# Altium project ADC1X2200-10_V1-1.PrjPCB (part 1 of 2)
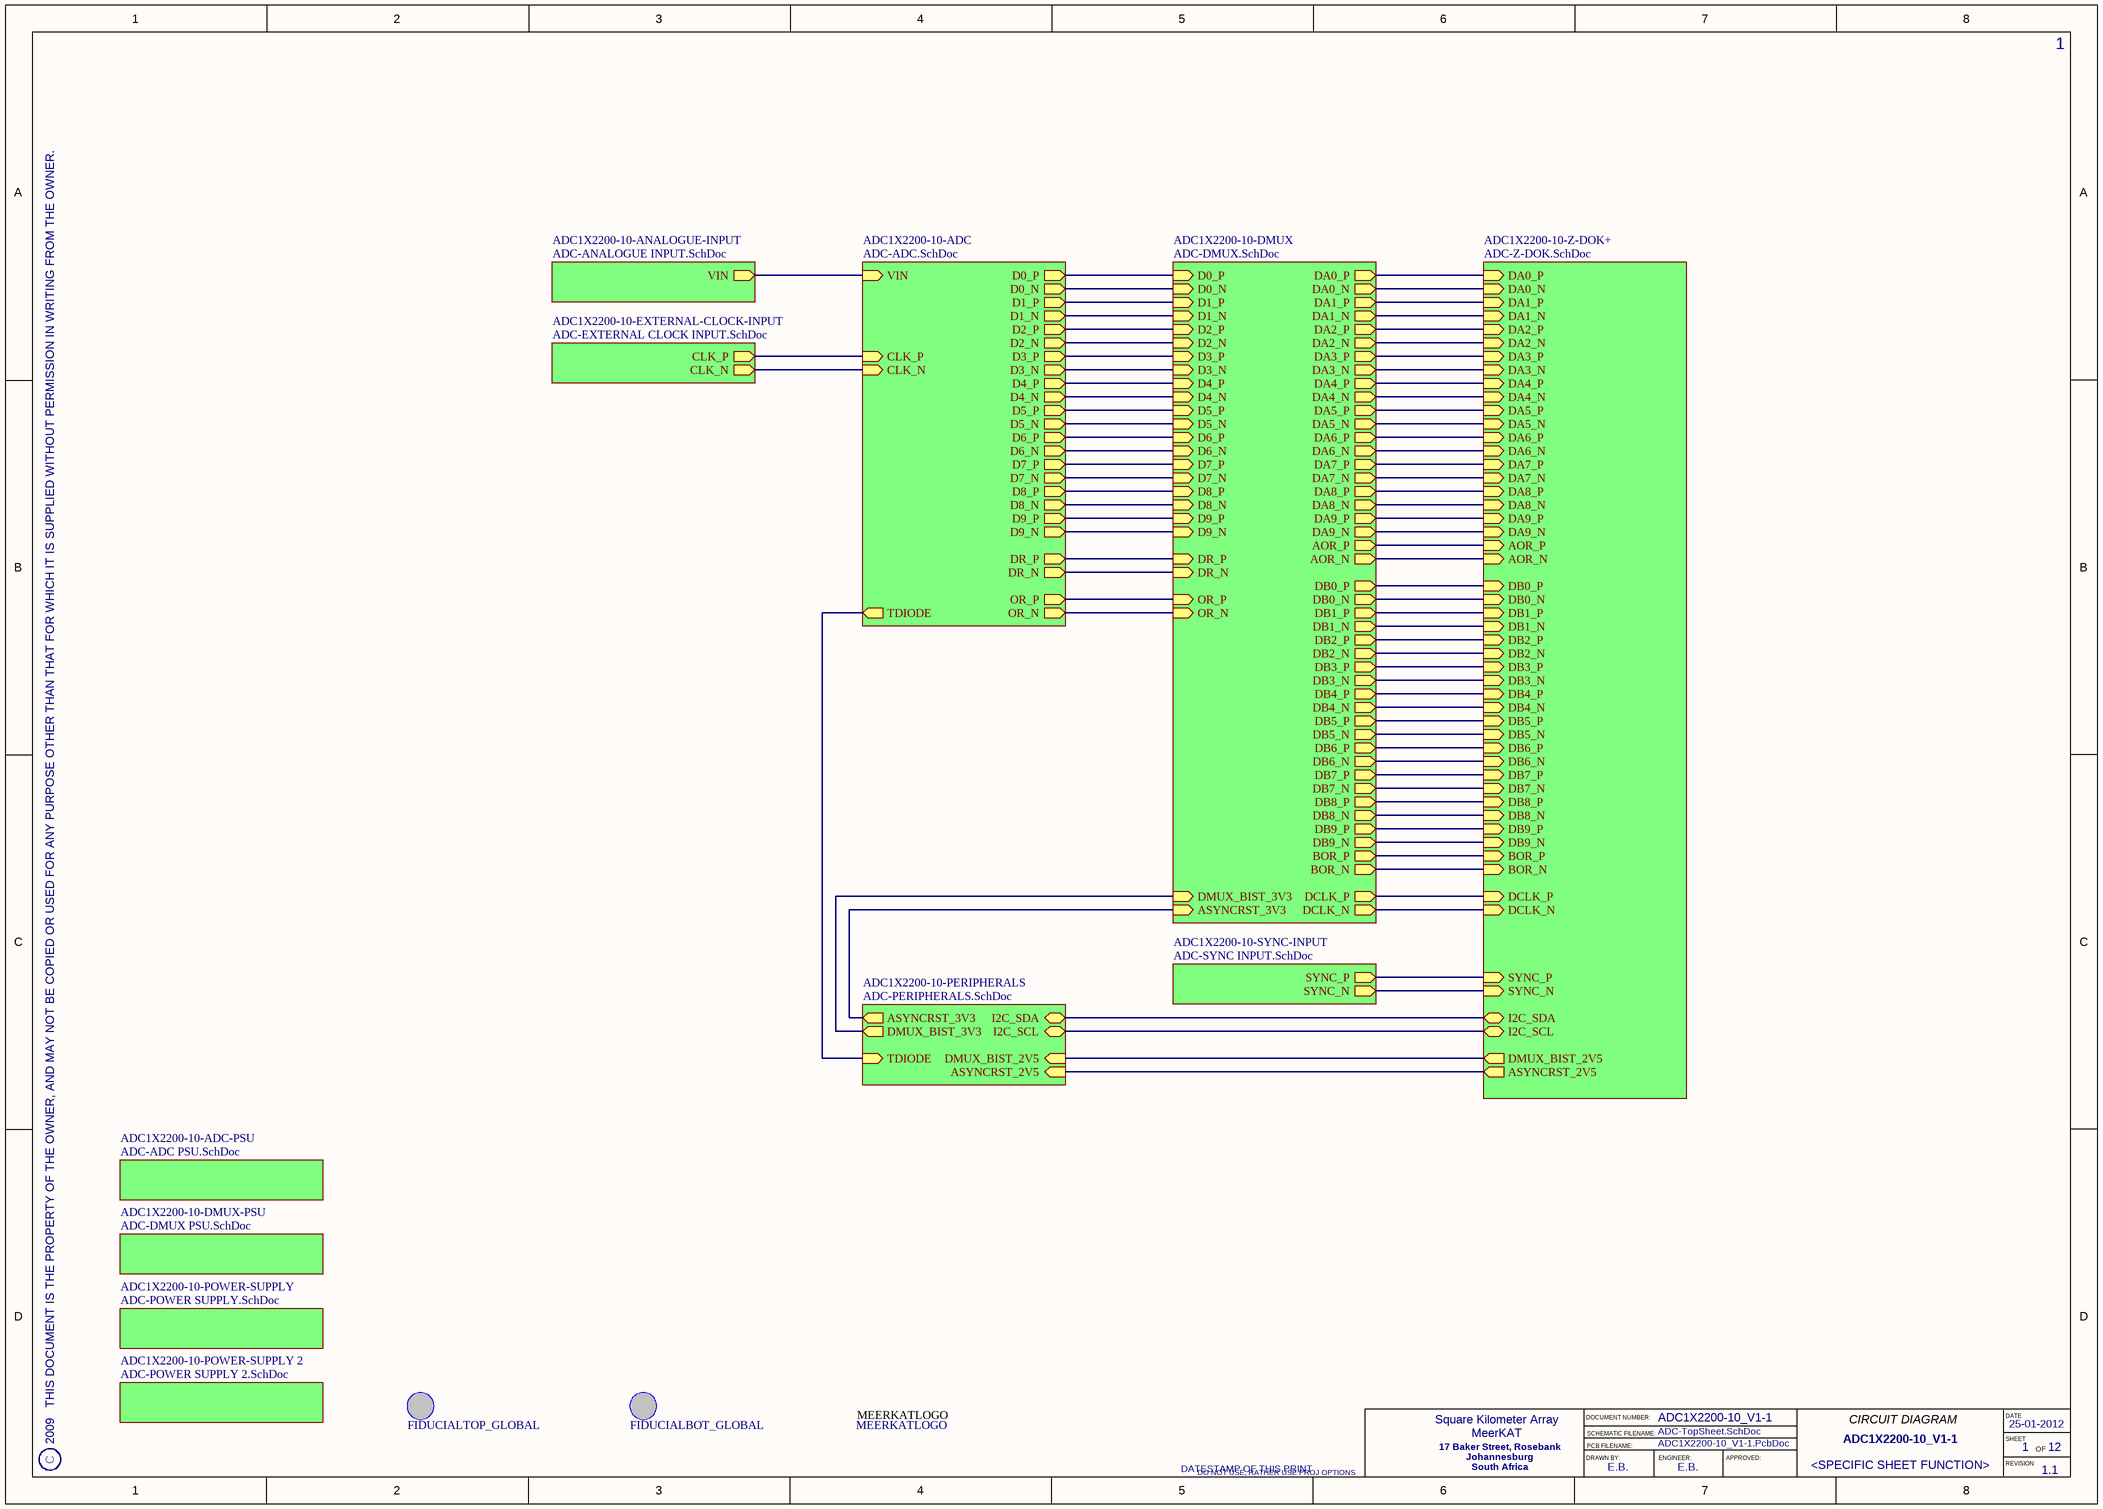
[diagram p0: ADC-TopSheet.SchDoc]
COMPANY_ADDRESS_1: 17 Baker Street, Rosebank; COMPANY_ADDRESS_2: Johannesburg; COMPANY_ADDRESS_3: South Africa; COMPANY_NAME1: Square Kilometer Array; COMPANY_NAME2: MeerKAT; COPYRIGHT_YEAR: 2012; GERBER FILENAME: ADC1X2200-10_V1-1; PCB_REVISION: 1.1; PCB_Title_Date: 25-01-2012; PCB_Title_Description: ADC1X2200-10_V1-1; PCB_Title_DocumentNumber: ADC1X2200-10_V1-1; PCB_Title_DrawnBy: E.B.; PCB_Title_Engineer: E.B.; PCB_Title_Filename: ADC1X2200-10_V1-1.PcbDoc; PROJECT_Filename: ADC1X2200-10_V1-1.PrjPCB; PROJECT_TITLE: ADC1X2200-10_V1-1; SCH_Title_Date: 25-01-2012; SCH_Title_DocumentNumber: ADC1X2200-10_V1-1; SCH_Title_DrawnBy: E.B.; SCH_Title_Engineer: E.B.
12 sheets, 237 parts. Net scope: hierarchical (ports join the sheet entries above them; power ports are global).
Board file: ADC1X2200-10_V1-1.PcbDoc
Sheets:
  ADC-TopSheet.SchDoc
    ADC1X2200-10-EXTERNAL-CLOCK-INPUT = ADC-EXTERNAL CLOCK INPUT.SchDoc
    ADC1X2200-10-ANALOGUE-INPUT = ADC-ANALOGUE INPUT.SchDoc
    ADC1X2200-10-PERIPHERALS = ADC-PERIPHERALS.SchDoc
    ADC1X2200-10-DMUX = ADC-DMUX.SchDoc
    ADC1X2200-10-Z-DOK+ = ADC-Z-DOK.SchDoc
    ADC1X2200-10-ADC = ADC-ADC.SchDoc
    ADC1X2200-10-POWER-SUPPLY 2 = ADC-POWER SUPPLY 2.SchDoc
    ADC1X2200-10-SYNC-INPUT = ADC-SYNC INPUT.SchDoc
    ADC1X2200-10-DMUX-PSU = ADC-DMUX PSU.SchDoc
    ADC1X2200-10-ADC-PSU = ADC-ADC PSU.SchDoc
    ADC1X2200-10-POWER-SUPPLY = ADC-POWER SUPPLY.SchDoc

## Sheet ADC-TopSheet.SchDoc: <SPECIFIC SHEET FUNCTION>
size A3; Date: DO NOT USE, RATHER USE PROJ OPTIONS; DrawnBy: DO NOT USE, RATHER USE PROJ OPTIONS; Engineer: DO NOT USE, RATHER USE PROJ OPTIONS; Organization: DO NOT USE, RATHER USE PROJ OPTIONS; DocumentNumber: 1; Revision: DO NOT USE, RATHER USE PROJ OPTIONS; SheetNumber: 1; SheetTotal: 12; SCH_Sheet_Filename: ADC-TopSheet.SchDoc; CurrentTime: DO NOT USE, RATHER USE PROJ OPTIONS; Time: DO NOT USE, RATHER USE PROJ OPTIONS; DocumentFullPathAndName: DO NOT USE, RATHER USE PROJ OPTIONS; DocumentName: DO NOT USE, RATHER USE PROJ OPTIONS; ModifiedDate: DO NOT USE, RATHER USE PROJ OPTIONS; ImagePath: DO NOT USE, RATHER USE PROJ OPTIONS

### Parts
F1  FIDUCIALTOP_GLOBAL  [FiducialTop_Global]
F4  FIDUCIALBOT_GLOBAL  [FiducialBot_Global]
LOGO1  MEERKATLOGO  [MEERKATLOGO]

### Sub-sheets
ADC1X2200-10-ADC = ADC-ADC.SchDoc: D0_P (out), D0_N (out), D1_P (out), D1_N (out), D2_P (out), D2_N (out), D3_P (out), D3_N (out), D4_P (out), D4_N (out), D5_P (out), D5_N (out), D6_P (out), D6_N (out), D7_P (out), D7_N (out), D8_P (out), D8_N (out), D9_P (out), D9_N (out), TDIODE (out), VIN (in), CLK_P (in), CLK_N (in), OR_P (out), OR_N (out), DR_P (out), DR_N (out)
ADC1X2200-10-ADC-PSU = ADC-ADC PSU.SchDoc: no entries
ADC1X2200-10-ANALOGUE-INPUT = ADC-ANALOGUE INPUT.SchDoc: VIN (out)
ADC1X2200-10-DMUX = ADC-DMUX.SchDoc: D0_P (in), D0_N (in), D1_P (in), D1_N (in), D2_P (in), D2_N (in), D3_P (in), D3_N (in), D4_P (in), D4_N (in), D5_P (in), D5_N (in), D6_P (in), D6_N (in), D7_P (in), D7_N (in), D8_P (in), D8_N (in), D9_P (in), D9_N (in), DA0_P (out), DA0_N (out), DA1_P (out), DA1_N (out), DA2_P (out), DA2_N (out), DA3_P (out), DA3_N (out), DA4_P (out), DA4_N (out), DA5_P (out), DA5_N (out), DA6_P (out), DA6_N (out), DA7_P (out), DA7_N (out), DA8_P (out), DA8_N (out), DA9_P (out), DA9_N (out), DB0_P (out), DB0_N (out), DB1_P (out), DB1_N (out), DB2_P (out), DB2_N (out), DB3_P (out), DB3_N (out), DB4_P (out), DB4_N (out), DB5_P (out), DB5_N (out), DB6_P (out), DB6_N (out), DB7_P (out), DB7_N (out), DB8_P (out), DB8_N (out), DB9_P (out), DB9_N (out), DCLK_N (out), DCLK_P (out), ASYNCRST_3V3 (in), DR_P (in), DR_N (in), OR_P (in), OR_N (in), AOR_P (out), AOR_N (out), BOR_P (out), BOR_N (out), DMUX_BIST_3V3 (in)
ADC1X2200-10-DMUX-PSU = ADC-DMUX PSU.SchDoc: no entries
ADC1X2200-10-EXTERNAL-CLOCK-INPUT = ADC-EXTERNAL CLOCK INPUT.SchDoc: CLK_P (out), CLK_N (out)
ADC1X2200-10-PERIPHERALS = ADC-PERIPHERALS.SchDoc: TDIODE (in), I2C_SDA (bidir), I2C_SCL, ASYNCRST_2V5 (in), ASYNCRST_3V3 (out), DMUX_BIST_2V5 (in), DMUX_BIST_3V3 (out)
ADC1X2200-10-POWER-SUPPLY = ADC-POWER SUPPLY.SchDoc: no entries
ADC1X2200-10-POWER-SUPPLY 2 = ADC-POWER SUPPLY 2.SchDoc: no entries
ADC1X2200-10-SYNC-INPUT = ADC-SYNC INPUT.SchDoc: SYNC_P (out), SYNC_N (out)
ADC1X2200-10-Z-DOK+ = ADC-Z-DOK.SchDoc: DA0_P (in), DA0_N (in), DA1_P (in), DA1_N (in), DA2_P (in), DA2_N (in), DA3_P (in), DA3_N (in), DA4_P (in), DA4_N (in), DA5_P (in), DA5_N (in), DA6_P (in), DA6_N (in), DA7_P (in), DA7_N (in), DA8_P (in), DA8_N (in), DA9_P (in), DA9_N (in), DB0_P (in), DB0_N (in), DB1_P (in), DB1_N (in), DB2_P (in), DB2_N (in), DB3_P (in), DB3_N (in), DB4_P (in), DB4_N (in), DB5_P (in), DB5_N (in), DB6_P (in), DB6_N (in), DB7_P (in), DB7_N (in), DB8_P (in), DB8_N (in), DB9_P (in), DB9_N (in), I2C_SDA (bidir), I2C_SCL (bidir), ASYNCRST_2V5 (out), SYNC_P (in), SYNC_N (in), DCLK_N (in), DCLK_P (in), AOR_P (in), AOR_N (in), BOR_P (in), BOR_N (in), DMUX_BIST_2V5 (out)

### Nets
AOR_N: sheet ADC1X2200-10-DMUX/AOR_N, sheet ADC1X2200-10-Z-DOK+/AOR_N
AOR_P: sheet ADC1X2200-10-DMUX/AOR_P, sheet ADC1X2200-10-Z-DOK+/AOR_P
ASYNCRST_2V5: sheet ADC1X2200-10-PERIPHERALS/ASYNCRST_2V5, sheet ADC1X2200-10-Z-DOK+/ASYNCRST_2V5
ASYNCRST_3V3: sheet ADC1X2200-10-PERIPHERALS/ASYNCRST_3V3, sheet ADC1X2200-10-DMUX/ASYNCRST_3V3
BOR_N: sheet ADC1X2200-10-DMUX/BOR_N, sheet ADC1X2200-10-Z-DOK+/BOR_N
BOR_P: sheet ADC1X2200-10-DMUX/BOR_P, sheet ADC1X2200-10-Z-DOK+/BOR_P
CLK_N: sheet ADC1X2200-10-EXTERNAL-CLOCK-INPUT/CLK_N, sheet ADC1X2200-10-ADC/CLK_N
CLK_P: sheet ADC1X2200-10-EXTERNAL-CLOCK-INPUT/CLK_P, sheet ADC1X2200-10-ADC/CLK_P
D0_N: sheet ADC1X2200-10-DMUX/D0_N, sheet ADC1X2200-10-ADC/D0_N
D0_P: sheet ADC1X2200-10-DMUX/D0_P, sheet ADC1X2200-10-ADC/D0_P
D1_N: sheet ADC1X2200-10-DMUX/D1_N, sheet ADC1X2200-10-ADC/D1_N
D1_P: sheet ADC1X2200-10-DMUX/D1_P, sheet ADC1X2200-10-ADC/D1_P
D2_N: sheet ADC1X2200-10-DMUX/D2_N, sheet ADC1X2200-10-ADC/D2_N
D2_P: sheet ADC1X2200-10-DMUX/D2_P, sheet ADC1X2200-10-ADC/D2_P
D3_N: sheet ADC1X2200-10-DMUX/D3_N, sheet ADC1X2200-10-ADC/D3_N
D3_P: sheet ADC1X2200-10-DMUX/D3_P, sheet ADC1X2200-10-ADC/D3_P
D4_N: sheet ADC1X2200-10-DMUX/D4_N, sheet ADC1X2200-10-ADC/D4_N
D4_P: sheet ADC1X2200-10-DMUX/D4_P, sheet ADC1X2200-10-ADC/D4_P
D5_N: sheet ADC1X2200-10-DMUX/D5_N, sheet ADC1X2200-10-ADC/D5_N
D5_P: sheet ADC1X2200-10-DMUX/D5_P, sheet ADC1X2200-10-ADC/D5_P
D6_N: sheet ADC1X2200-10-DMUX/D6_N, sheet ADC1X2200-10-ADC/D6_N
D6_P: sheet ADC1X2200-10-DMUX/D6_P, sheet ADC1X2200-10-ADC/D6_P
D7_N: sheet ADC1X2200-10-DMUX/D7_N, sheet ADC1X2200-10-ADC/D7_N
D7_P: sheet ADC1X2200-10-DMUX/D7_P, sheet ADC1X2200-10-ADC/D7_P
D8_N: sheet ADC1X2200-10-DMUX/D8_N, sheet ADC1X2200-10-ADC/D8_N
D8_P: sheet ADC1X2200-10-DMUX/D8_P, sheet ADC1X2200-10-ADC/D8_P
D9_N: sheet ADC1X2200-10-DMUX/D9_N, sheet ADC1X2200-10-ADC/D9_N
D9_P: sheet ADC1X2200-10-DMUX/D9_P, sheet ADC1X2200-10-ADC/D9_P
DA0_N: sheet ADC1X2200-10-DMUX/DA0_N, sheet ADC1X2200-10-Z-DOK+/DA0_N
DA0_P: sheet ADC1X2200-10-DMUX/DA0_P, sheet ADC1X2200-10-Z-DOK+/DA0_P
DA1_N: sheet ADC1X2200-10-DMUX/DA1_N, sheet ADC1X2200-10-Z-DOK+/DA1_N
DA1_P: sheet ADC1X2200-10-DMUX/DA1_P, sheet ADC1X2200-10-Z-DOK+/DA1_P
DA2_N: sheet ADC1X2200-10-DMUX/DA2_N, sheet ADC1X2200-10-Z-DOK+/DA2_N
DA2_P: sheet ADC1X2200-10-DMUX/DA2_P, sheet ADC1X2200-10-Z-DOK+/DA2_P
DA3_N: sheet ADC1X2200-10-DMUX/DA3_N, sheet ADC1X2200-10-Z-DOK+/DA3_N
DA3_P: sheet ADC1X2200-10-DMUX/DA3_P, sheet ADC1X2200-10-Z-DOK+/DA3_P
DA4_N: sheet ADC1X2200-10-DMUX/DA4_N, sheet ADC1X2200-10-Z-DOK+/DA4_N
DA4_P: sheet ADC1X2200-10-DMUX/DA4_P, sheet ADC1X2200-10-Z-DOK+/DA4_P
DA5_N: sheet ADC1X2200-10-DMUX/DA5_N, sheet ADC1X2200-10-Z-DOK+/DA5_N
DA5_P: sheet ADC1X2200-10-DMUX/DA5_P, sheet ADC1X2200-10-Z-DOK+/DA5_P
DA6_N: sheet ADC1X2200-10-DMUX/DA6_N, sheet ADC1X2200-10-Z-DOK+/DA6_N
DA6_P: sheet ADC1X2200-10-DMUX/DA6_P, sheet ADC1X2200-10-Z-DOK+/DA6_P
DA7_N: sheet ADC1X2200-10-DMUX/DA7_N, sheet ADC1X2200-10-Z-DOK+/DA7_N
DA7_P: sheet ADC1X2200-10-DMUX/DA7_P, sheet ADC1X2200-10-Z-DOK+/DA7_P
DA8_N: sheet ADC1X2200-10-DMUX/DA8_N, sheet ADC1X2200-10-Z-DOK+/DA8_N
DA8_P: sheet ADC1X2200-10-DMUX/DA8_P, sheet ADC1X2200-10-Z-DOK+/DA8_P
DA9_N: sheet ADC1X2200-10-DMUX/DA9_N, sheet ADC1X2200-10-Z-DOK+/DA9_N
DA9_P: sheet ADC1X2200-10-DMUX/DA9_P, sheet ADC1X2200-10-Z-DOK+/DA9_P
DB0_N: sheet ADC1X2200-10-DMUX/DB0_N, sheet ADC1X2200-10-Z-DOK+/DB0_N
DB0_P: sheet ADC1X2200-10-DMUX/DB0_P, sheet ADC1X2200-10-Z-DOK+/DB0_P
DB1_N: sheet ADC1X2200-10-DMUX/DB1_N, sheet ADC1X2200-10-Z-DOK+/DB1_N
DB1_P: sheet ADC1X2200-10-DMUX/DB1_P, sheet ADC1X2200-10-Z-DOK+/DB1_P
DB2_N: sheet ADC1X2200-10-DMUX/DB2_N, sheet ADC1X2200-10-Z-DOK+/DB2_N
DB2_P: sheet ADC1X2200-10-DMUX/DB2_P, sheet ADC1X2200-10-Z-DOK+/DB2_P
DB3_N: sheet ADC1X2200-10-DMUX/DB3_N, sheet ADC1X2200-10-Z-DOK+/DB3_N
DB3_P: sheet ADC1X2200-10-DMUX/DB3_P, sheet ADC1X2200-10-Z-DOK+/DB3_P
DB4_N: sheet ADC1X2200-10-DMUX/DB4_N, sheet ADC1X2200-10-Z-DOK+/DB4_N
DB4_P: sheet ADC1X2200-10-DMUX/DB4_P, sheet ADC1X2200-10-Z-DOK+/DB4_P
DB5_N: sheet ADC1X2200-10-DMUX/DB5_N, sheet ADC1X2200-10-Z-DOK+/DB5_N
DB5_P: sheet ADC1X2200-10-DMUX/DB5_P, sheet ADC1X2200-10-Z-DOK+/DB5_P
DB6_N: sheet ADC1X2200-10-DMUX/DB6_N, sheet ADC1X2200-10-Z-DOK+/DB6_N
DB6_P: sheet ADC1X2200-10-DMUX/DB6_P, sheet ADC1X2200-10-Z-DOK+/DB6_P
DB7_N: sheet ADC1X2200-10-DMUX/DB7_N, sheet ADC1X2200-10-Z-DOK+/DB7_N
DB7_P: sheet ADC1X2200-10-DMUX/DB7_P, sheet ADC1X2200-10-Z-DOK+/DB7_P
DB8_N: sheet ADC1X2200-10-DMUX/DB8_N, sheet ADC1X2200-10-Z-DOK+/DB8_N
DB8_P: sheet ADC1X2200-10-DMUX/DB8_P, sheet ADC1X2200-10-Z-DOK+/DB8_P
DB9_N: sheet ADC1X2200-10-DMUX/DB9_N, sheet ADC1X2200-10-Z-DOK+/DB9_N
DB9_P: sheet ADC1X2200-10-DMUX/DB9_P, sheet ADC1X2200-10-Z-DOK+/DB9_P
DCLK_N: sheet ADC1X2200-10-DMUX/DCLK_N, sheet ADC1X2200-10-Z-DOK+/DCLK_N
DCLK_P: sheet ADC1X2200-10-DMUX/DCLK_P, sheet ADC1X2200-10-Z-DOK+/DCLK_P
DMUX_BIST_2V5: sheet ADC1X2200-10-PERIPHERALS/DMUX_BIST_2V5, sheet ADC1X2200-10-Z-DOK+/DMUX_BIST_2V5
DMUX_BIST_3V3: sheet ADC1X2200-10-PERIPHERALS/DMUX_BIST_3V3, sheet ADC1X2200-10-DMUX/DMUX_BIST_3V3
DR_N: sheet ADC1X2200-10-DMUX/DR_N, sheet ADC1X2200-10-ADC/DR_N
DR_P: sheet ADC1X2200-10-DMUX/DR_P, sheet ADC1X2200-10-ADC/DR_P
I2C_SCL: sheet ADC1X2200-10-PERIPHERALS/I2C_SCL, sheet ADC1X2200-10-Z-DOK+/I2C_SCL
I2C_SDA: sheet ADC1X2200-10-PERIPHERALS/I2C_SDA, sheet ADC1X2200-10-Z-DOK+/I2C_SDA
OR_N: sheet ADC1X2200-10-DMUX/OR_N, sheet ADC1X2200-10-ADC/OR_N
OR_P: sheet ADC1X2200-10-DMUX/OR_P, sheet ADC1X2200-10-ADC/OR_P
SYNC_N: sheet ADC1X2200-10-Z-DOK+/SYNC_N, sheet ADC1X2200-10-SYNC-INPUT/SYNC_N
SYNC_P: sheet ADC1X2200-10-Z-DOK+/SYNC_P, sheet ADC1X2200-10-SYNC-INPUT/SYNC_P
TDIODE: sheet ADC1X2200-10-PERIPHERALS/TDIODE, sheet ADC1X2200-10-ADC/TDIODE
VIN: sheet ADC1X2200-10-ANALOGUE-INPUT/VIN, sheet ADC1X2200-10-ADC/VIN

### Notes on the sheet
- 2009   THIS DOCUMENT IS THE PROPERTY OF THE OWNER, AND MAY NOT BE COPIED OR USED FOR ANY PURPOSE OTHER THAN THAT FOR WHICH IT IS SUPPLIED WITHOUT PERMISSION IN WRITING FROM THE OWNER.
- C
- DATESTAMP OF THIS PRINT
- DRAWN BY:
- DOCUMENT NUMBER:
- SCHEMATIC FILENAME:
- PCB FILENAME:
- ENGINEER:
- APPROVED:
- CIRCUIT DIAGRAM
- DATE
- SHEET
- REVISION
- OF

### Library data of the parts
F1 = FIDUCIALTOP_GLOBAL: Value: ????; Manufacturer: *; Manufacturer_PN: *; Created_By: *; Checked_By: *; Checked_Date: *; HelpURL: *; ComponentLink1Description: Footprint Detail; ComponentLink1URL: *; ComponentLink2Description: Application Note; ComponentLink2URL: *; ComponentLink3Description: Layout Guidelines; ComponentLink3URL: *; ComponentLink4Description: Technology Reference; ComponentLink4URL: *; Supplier1: *; Supplier2: *; Unit_Cost: *; MOQ: *; Leadtime: *; Inventory_Stock: *; Tolerance: *; Wattage: *; Voltage: *; Package: *; ComponentLink5Description: Production Detail; ComponentLink5URL: *; Note: *; Stock Code: *
F4 = FIDUCIALBOT_GLOBAL: Value: ????; Manufacturer: *; Manufacturer_PN: *; Created_By: *; Checked_By: *; Checked_Date: *; HelpURL: *; ComponentLink1Description: Footprint Detail; ComponentLink1URL: *; ComponentLink2Description: Application Note; ComponentLink2URL: *; ComponentLink3Description: Layout Guidelines; ComponentLink3URL: *; ComponentLink4Description: Technology Reference; ComponentLink4URL: *; Supplier1: *; Supplier2: *; Unit_Cost: *; MOQ: *; Leadtime: *; Inventory_Stock: *; Tolerance: *; Wattage: *; Voltage: *; Package: *; ComponentLink5Description: Production Detail; ComponentLink5URL: *; Note: *; Stock Code: *

## Sheet ADC-EXTERNAL CLOCK INPUT.SchDoc: <SPECIFIC SHEET FUNCTION>
size A3; Date: DO NOT USE, RATHER USE PROJ OPTIONS; DrawnBy: DO NOT USE, RATHER USE PROJ OPTIONS; Engineer: DO NOT USE, RATHER USE PROJ OPTIONS; Organization: DO NOT USE, RATHER USE PROJ OPTIONS; DocumentNumber: 3; Revision: DO NOT USE, RATHER USE PROJ OPTIONS; SheetNumber: 4; SheetTotal: 12; SCH_Sheet_Filename: ADC-EXTERNAL CLOCK INPUT.SchDoc; CurrentTime: DO NOT USE, RATHER USE PROJ OPTIONS; Time: DO NOT USE, RATHER USE PROJ OPTIONS; DocumentFullPathAndName: DO NOT USE, RATHER USE PROJ OPTIONS; DocumentName: DO NOT USE, RATHER USE PROJ OPTIONS; ModifiedDate: DO NOT USE, RATHER USE PROJ OPTIONS; ImagePath: DO NOT USE, RATHER USE PROJ OPTIONS
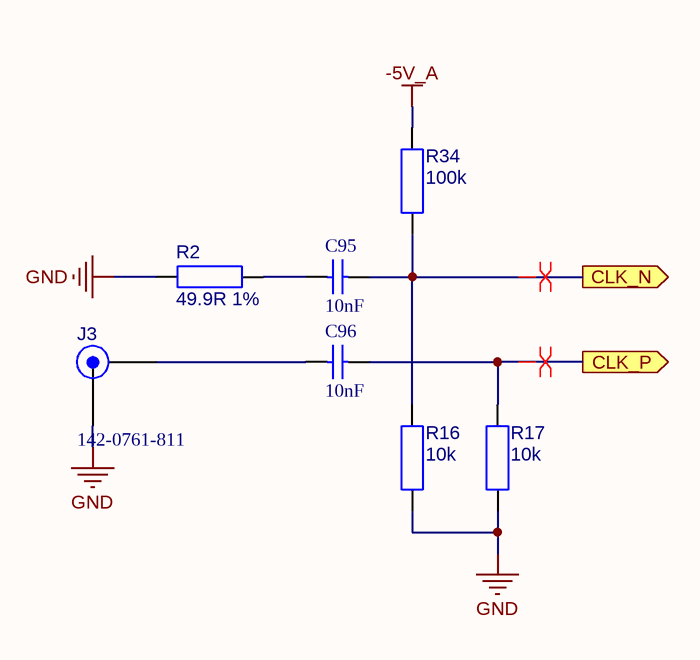
[diagram p1: ADC-EXTERNAL CLOCK INPUT.SchDoc]

### Parts
C95  value 10nF  [CAPC1005X55N]  (hidden comment: Capacitor 0402 SMD)
C96  value 10nF  [CAPC1005X55N]  (hidden comment: Capacitor 0402 SMD)
J3  142-0761-811  [EDGE_LAUNCH_TH_SMA]
R2  49.9R 1%  [0603]
R16  10k  [0603]
R17  10k  [0603]
R34  100k  [0603]

### Ports
CLK_N (out), CLK_P (out)

### Nets
-5V_A: R34.2
GND: J3.2 R2.1 R16.1 R17.1
CLK_N: C95.2 R16.2 R34.1 ; port CLK_N
CLK_P: C96.2 R17.2 ; port CLK_P
NetC95_1: C95.1 R2.2
NetC96_1: C96.1 J3.1

### Layout directives
differential pair: CLK_N, CLK_P

### Notes on the sheet
- 2009   THIS DOCUMENT IS THE PROPERTY OF THE OWNER, AND MAY NOT BE COPIED OR USED FOR ANY PURPOSE OTHER THAN THAT FOR WHICH IT IS SUPPLIED WITHOUT PERMISSION IN WRITING FROM THE OWNER.
- C
- DATESTAMP OF THIS PRINT
- DRAWN BY:
- DOCUMENT NUMBER:
- SCHEMATIC FILENAME:
- PCB FILENAME:
- ENGINEER:
- APPROVED:
- CIRCUIT DIAGRAM
- DATE
- SHEET
- REVISION
- OF

### Library data of the parts
C95 C96 = cap0402: Created_By: EDA-ASA; Checked_By: *; Checked_Date: *; HelpURL: *; Supplier1: *; Supplier2: *; Unit_Cost: *; MOQ: *; Leadtime: *; Inventory_Stock: *; Tolerance: *; Wattage: *; Package: 0402; ComponentLinked1Description: *; ComponentLinked1URL: *; ComponentLinked2Description: *; ComponentLinked2URL: *; ComponentLinked3Description: *; ComponentLinked3URL: *; ComponentLinked4Description: *; ComponentLinked4URL: *
J3 = 142-0761-811: High Frequency SMA End Lauch Connector; Manufacturer: JOHNSON; Created_By: CT; Checked_By: *; Checked_Date: *; HelpURL: *; ComponentLink1Description: High Frequency SMA End Lauch Connector; ComponentLink1URL: *; ComponentLink2Description: Application Note; ComponentLink2URL: *; ComponentLink3Description: Layout Guidelines; ComponentLink3URL: *; ComponentLink4Description: Technology Reference; ComponentLink4URL: *; Supplier1: *; Supplier2: *; Unit_Cost: *; MOQ: *; Leadtime: *; Inventory_Stock: *; Tolerance: *; Wattage: *; Package: *; ComponentLink5Description: Production Detail; ComponentLink5URL: *; Note: *; Stock Code: *; Voltage: *; Manufacturer_PN: 142-0761-811
R2 R16 R17 R34 = RES-0805: RESISTOR SMD 0603; Checked_By: NN; Manufacturer: *; Manufacturer_PN: *; Created_By: *; Checked_Date: 5-08-2009; HelpURL: *; ComponentLink1Description: Footprint Detail; ComponentLink1URL: *; ComponentLink2Description: Application Note; ComponentLink2URL: *; ComponentLink3Description: Layout Guidelines; ComponentLink3URL: *; ComponentLink4Description: Technology Reference; ComponentLink4URL: *; Supplier1: *; Supplier2: *; Unit_Cost: *; MOQ: *; Leadtime: *; Inventory_Stock: *; Tolerance: *; Wattage: *; Voltage: *; Package: 0603; ComponentLink5Description: Production Detail; ComponentLink5URL: *; Note: *; Stock Code: *
  R2: Value: 49.9R 1%
  R16 R17: Value: 10k
  R34: Value: 100k

## Sheet ADC-ANALOGUE INPUT.SchDoc: <SPECIFIC SHEET FUNCTION>
size A3; Date: DO NOT USE, RATHER USE PROJ OPTIONS; DrawnBy: DO NOT USE, RATHER USE PROJ OPTIONS; Engineer: DO NOT USE, RATHER USE PROJ OPTIONS; Organization: DO NOT USE, RATHER USE PROJ OPTIONS; DocumentNumber: 4; Revision: DO NOT USE, RATHER USE PROJ OPTIONS; SheetNumber: 3; SheetTotal: 12; SCH_Sheet_Filename: ADC-ANALOGUE INPUT.SchDoc; CurrentTime: DO NOT USE, RATHER USE PROJ OPTIONS; Time: DO NOT USE, RATHER USE PROJ OPTIONS; DocumentFullPathAndName: DO NOT USE, RATHER USE PROJ OPTIONS; DocumentName: DO NOT USE, RATHER USE PROJ OPTIONS; ModifiedDate: DO NOT USE, RATHER USE PROJ OPTIONS; ImagePath: DO NOT USE, RATHER USE PROJ OPTIONS
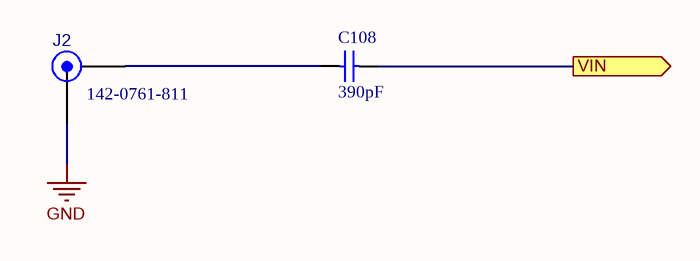
[diagram p2: ADC-ANALOGUE INPUT.SchDoc]

### Parts
C108  value 390pF  [CAPC1005X55N]  (hidden comment: Capacitor 0402 SMD)
J2  142-0761-811  [EDGE_LAUNCH_TH_SMA]

### Ports
VIN (out)

### Nets
GND: J2.2
VIN: C108.2 ; port VIN
NetC108_1: C108.1 J2.1

### Notes on the sheet
- 2009   THIS DOCUMENT IS THE PROPERTY OF THE OWNER, AND MAY NOT BE COPIED OR USED FOR ANY PURPOSE OTHER THAN THAT FOR WHICH IT IS SUPPLIED WITHOUT PERMISSION IN WRITING FROM THE OWNER.
- C
- DATESTAMP OF THIS PRINT
- DRAWN BY:
- DOCUMENT NUMBER:
- SCHEMATIC FILENAME:
- PCB FILENAME:
- ENGINEER:
- APPROVED:
- CIRCUIT DIAGRAM
- DATE
- SHEET
- REVISION
- OF

### Library data of the parts
C108 = cap0402: Created_By: EDA-ASA; Checked_By: *; Checked_Date: *; HelpURL: *; Supplier1: *; Supplier2: *; Unit_Cost: *; MOQ: *; Leadtime: *; Inventory_Stock: *; Tolerance: *; Wattage: *; Package: 0402; ComponentLinked1Description: *; ComponentLinked1URL: *; ComponentLinked2Description: *; ComponentLinked2URL: *; ComponentLinked3Description: *; ComponentLinked3URL: *; ComponentLinked4Description: *; ComponentLinked4URL: *
J2 = 142-0761-811: as J3 on sheet ADC-EXTERNAL CLOCK INPUT; Checked_By: *; Checked_Date: *; HelpURL: *; ComponentLink1Description: High Frequency SMA End Lauch Connector; ComponentLink1URL: *; ComponentLink2Description: Application Note; ComponentLink2URL: *; ComponentLink3Description: Layout Guidelines; ComponentLink3URL: *; ComponentLink4Description: Technology Reference; ComponentLink4URL: *; Supplier1: *; Supplier2: *; Unit_Cost: *; MOQ: *; Leadtime: *; Inventory_Stock: *; Tolerance: *; Wattage: *; Package: *; ComponentLink5Description: Production Detail; ComponentLink5URL: *; Note: *; Stock Code: *; Voltage: *; Manufacturer_PN: 142-0761-811

## Sheet ADC-PERIPHERALS.SchDoc: <SPECIFIC SHEET FUNCTION>
size A3; Date: DO NOT USE, RATHER USE PROJ OPTIONS; DrawnBy: DO NOT USE, RATHER USE PROJ OPTIONS; Engineer: DO NOT USE, RATHER USE PROJ OPTIONS; Organization: DO NOT USE, RATHER USE PROJ OPTIONS; DocumentNumber: 5; Revision: DO NOT USE, RATHER USE PROJ OPTIONS; SheetNumber: 8; SheetTotal: 12; SCH_Sheet_Filename: ADC-Peripherals.SchDoc; CurrentTime: DO NOT USE, RATHER USE PROJ OPTIONS; Time: DO NOT USE, RATHER USE PROJ OPTIONS; DocumentFullPathAndName: DO NOT USE, RATHER USE PROJ OPTIONS; DocumentName: DO NOT USE, RATHER USE PROJ OPTIONS; ModifiedDate: DO NOT USE, RATHER USE PROJ OPTIONS; ImagePath: DO NOT USE, RATHER USE PROJ OPTIONS
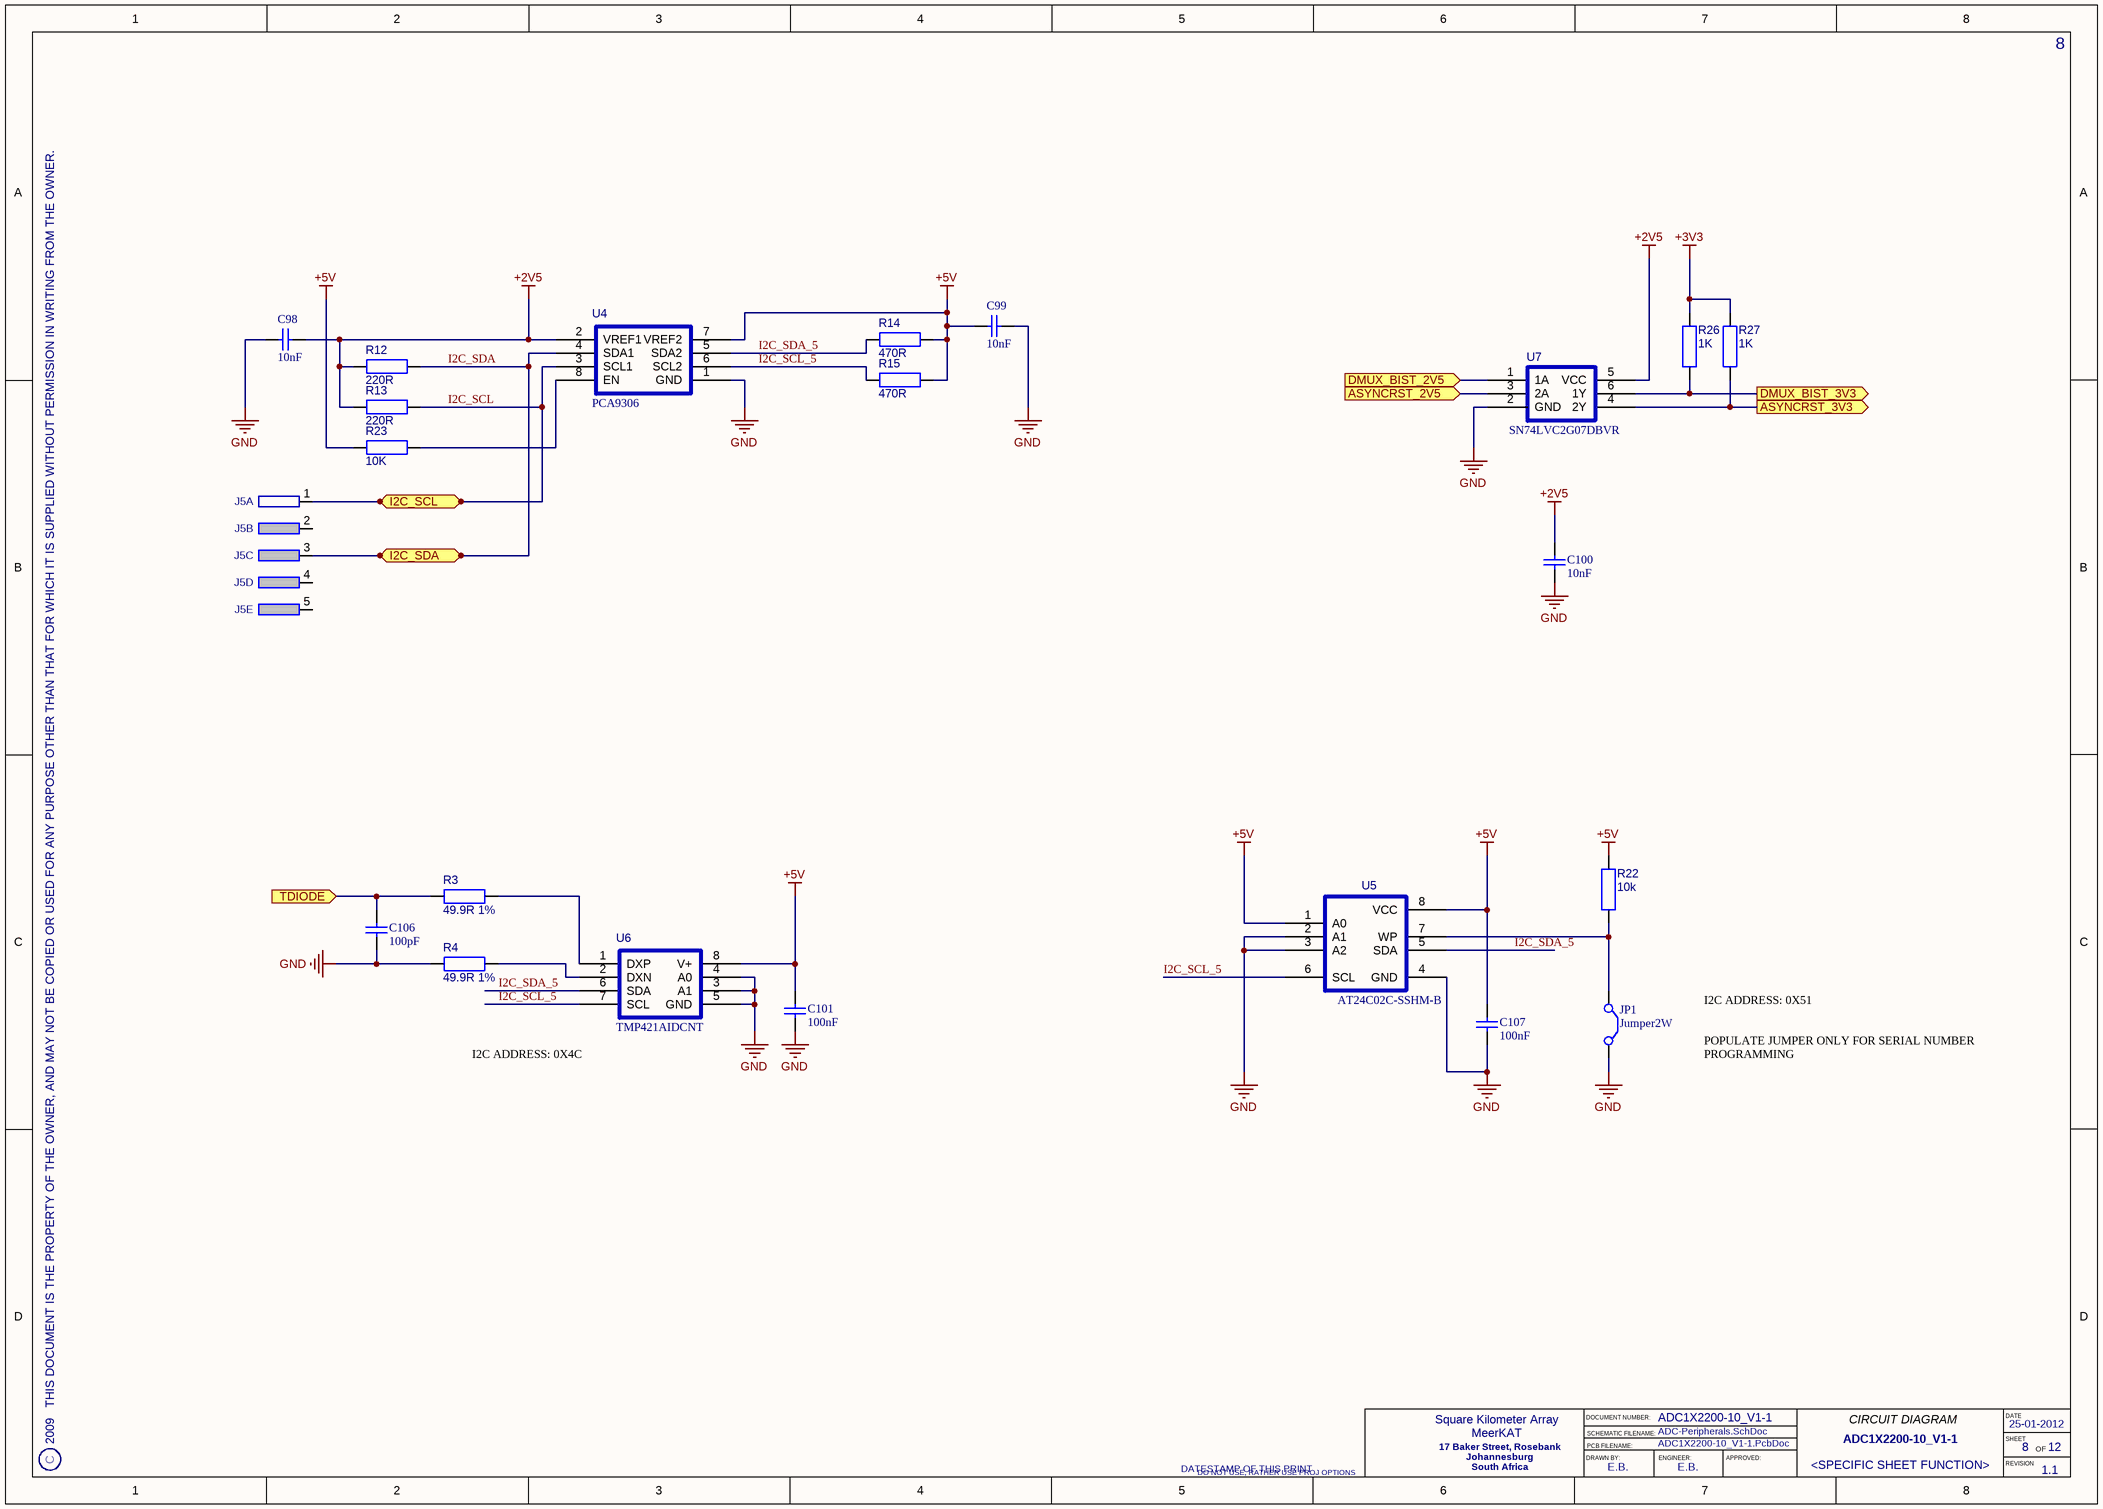
[diagram p3: ADC-PERIPHERALS.SchDoc]

### Parts
C98  value 10nF  [CAPC1005X55N]  (hidden comment: Capacitor 0402 SMD)
C99  value 10nF  [CAPC1005X55N]  (hidden comment: Capacitor 0402 SMD)
C100  value 10nF  [CAPC1005X55N]  (hidden comment: Capacitor 0402 SMD)
C101  value 100nF  [CAPC1005X55N]  (hidden comment: Capacitor 0402 SMD)
C106  value 100pF  [CAPC1005X55N]  (hidden comment: Capacitor 0402 SMD)
C107  value 100nF  [CAPC1005X55N]  (hidden comment: Capacitor 0402 SMD)
J5  SAMTEC-TSM-105-01-TM-SV-5W-HDR  [TSM_5X1_SV]  (value not drawn)  (parts A,B,C,D,E of 5)
JP1  Jumper2W  [JP-100MIL]
R3  49.9R 1%  [0603]
R4  49.9R 1%  [0603]
R12  220R  [0603]
R13  220R  [0603]
R14  470R  [0603]
R15  470R  [0603]
R22  10k  [0603]
R23  10K  [0603]
R26  1K  [0603]
R27  1K  [0603]
U4  PCA9306  [SOP65P400X130-8USR]
U5  AT24C02C-SSHM-B  [SOIC127P600X175-8N]
U6  TMP421AIDCNT  [TI_SOT23-8]
U7  SN74LVC2G07DBVR  [SOT95P280X145-6N]

### Ports
ASYNCRST_2V5 (in), ASYNCRST_3V3 (out), DMUX_BIST_2V5 (in), DMUX_BIST_3V3 (out), I2C_SCL (bidir), I2C_SDA (bidir), TDIODE (in)

### Nets
+2V5: C98.2 C100.2 R12.1 R13.1 U4.2(VREF1) U7.5(VCC)
+3V3: R26.1 R27.1
+5V: C99.1 C101.2 C107.2 R14.2 R15.2 R22.1 R23.2 U4.7(VREF2) U5.1(A0) U5.8(VCC) U6.8(V+)
GND: C98.1 C99.2 C100.1 C101.1 C106.1 C107.1 JP1.2(C2) R4.1 U4.1(GND) U5.2(A1) U5.3(A2) U5.4(GND) U6.3(A1) U6.4(A0) U6.5(GND) U7.2(GND)
ASYNCRST_2V5: U7.3(2A) ; port ASYNCRST_2V5
ASYNCRST_3V3: R27.2 U7.4(2Y) ; port ASYNCRST_3V3
DMUX_BIST_2V5: U7.1(1A) ; port DMUX_BIST_2V5
DMUX_BIST_3V3: R26.2 U7.6(1Y) ; port DMUX_BIST_3V3
I2C_SCL: J5.1 R13.2 U4.3(SCL1) ; port I2C_SCL
I2C_SCL_5: R15.1 U4.6(SCL2) U5.6(SCL) U6.7(SCL)
I2C_SDA: J5.3 R12.2 U4.4(SDA1) ; port I2C_SDA
I2C_SDA_5: R14.1 U4.5(SDA2) U5.5(SDA) U6.6(SDA)
TDIODE: C106.2 R3.1 ; port TDIODE
NetJP1_1: JP1.1(C1) R22.2 U5.7(WP)
NetR3_2: R3.2 U6.1(DXP)
NetR4_2: R4.2 U6.2(DXN)
NetR23_1: R23.1 U4.8(EN)

Not connected (* = marked no-connect by the designer): J5 2 4 5

### Notes on the sheet
- I2C ADDRESS: 0X51
- (near U6) I2C ADDRESS: 0X4C
- POPULATE JUMPER ONLY FOR SERIAL NUMBER PROGRAMMING
- 2009   THIS DOCUMENT IS THE PROPERTY OF THE OWNER, AND MAY NOT BE COPIED OR USED FOR ANY PURPOSE OTHER THAN THAT FOR WHICH IT IS SUPPLIED WITHOUT PERMISSION IN WRITING FROM THE OWNER.
- C
- DATESTAMP OF THIS PRINT
- DRAWN BY:
- DOCUMENT NUMBER:
- SCHEMATIC FILENAME:
- PCB FILENAME:
- ENGINEER:
- APPROVED:
- CIRCUIT DIAGRAM
- DATE
- SHEET
- REVISION
- OF

### Library data of the parts
C98-C101 C106 C107 = cap0402: Created_By: EDA-ASA; Checked_By: *; Checked_Date: *; HelpURL: *; Supplier1: *; Supplier2: *; Unit_Cost: *; MOQ: *; Leadtime: *; Inventory_Stock: *; Tolerance: *; Wattage: *; Package: 0402; ComponentLinked1Description: *; ComponentLinked1URL: *; ComponentLinked2Description: *; ComponentLinked2URL: *; ComponentLinked3Description: *; ComponentLinked3URL: *; ComponentLinked4Description: *; ComponentLinked4URL: *
JP1 = Jumper2W: Jumper Wire; Published: 24-Mar-1999; LatestRevisionDate: 17-Jul-2002; LatestRevisionNote: Re-released for DXP Platform.; PackageReference: RAD-0.2; Publisher: Altium Limited
R3 R4 R12-R15 R22 R23 R26 R27 = RES-0805: RESISTOR SMD 0603; Checked_By: NN; Manufacturer: *; Manufacturer_PN: *; Created_By: *; Checked_Date: 5-08-2009; HelpURL: *; ComponentLink1Description: Footprint Detail; ComponentLink1URL: *; ComponentLink2Description: Application Note; ComponentLink2URL: *; ComponentLink3Description: Layout Guidelines; ComponentLink3URL: *; ComponentLink4Description: Technology Reference; ComponentLink4URL: *; Supplier1: *; Supplier2: *; Unit_Cost: *; MOQ: *; Leadtime: *; Inventory_Stock: *; Tolerance: *; Wattage: *; Voltage: *; Package: 0603; ComponentLink5Description: Production Detail; ComponentLink5URL: *; Note: *; Stock Code: *
  R3 R4: Value: 49.9R 1%
  R12 R13: Value: 220R
  R14 R15: Value: 470R
  R22: Value: 10k
  R23: Value: 10K
  R26 R27: Value: 1K
U4 = PCA9306DCTR: Dual Bidirectional I2C Bus and SMBus Voltage-Level Translator; Manufacturer: TI; Created_By: IN; Manufacturer_PN: PCA9306; Checked_By: *; Checked_Date: *; HelpURL: X:\Datasheets\By_Manufacturer\TI\pca9306.pdf; ComponentLink1Description: Footprint Detail; ComponentLink1URL: *; ComponentLink2Description: Application Note; ComponentLink2URL: *; ComponentLink3Description: Layout Guidelines; ComponentLink3URL: *; ComponentLink4Description: Technology Reference; ComponentLink4URL: *; Supplier1: *; Supplier2: *; Unit_Cost: *; MOQ: *; Leadtime: *; Inventory_Stock: *; Tolerance: *; Wattage: *; Voltage: *; Package: *; ComponentLink5Description: Production Detail; ComponentLink5URL: *; Note: *; Stock Code: *
U5 = AT24C02B: Two wire Serial EEPROM 2K (256 x 8); Manufacturer: Atmel; Created_By: IN; Manufacturer_PN: AT24C02C-SSHM-B; Checked_By: *; Checked_Date: *; HelpURL: X:\Datasheets\By_Manufacturer\ATMEL\at24c02b.pdf; ComponentLink1Description: Footprint Detail; ComponentLink1URL: *; ComponentLink2Description: Application Note; ComponentLink2URL: *; ComponentLink3Description: Layout Guidelines; ComponentLink3URL: *; ComponentLink4Description: Technology Reference; ComponentLink4URL: *; Supplier1: *; Supplier2: *; Unit_Cost: *; MOQ: *; Leadtime: *; Inventory_Stock: *; Tolerance: *; Wattage: *; Voltage: *; Package: *; ComponentLink5Description: Production Detail; ComponentLink5URL: *; Note: *; Stock Code: *
U6 = TMP421AIDCNT: Remote and Local TempreatureSensor in SOT23-8; Manufacturer: TI; Manufacturer_PN: TMP421AIDCNT; Created_By: IN; Checked_By: *; Checked_Date: *; HelpURL: X:Datasheets\By_Manufacturer\TI\tmp421.pdf; ComponentLink1Description: Footprint Detail; ComponentLink1URL: X:Datasheets\By_Manufacturer\TI\tmp421.pdf; ComponentLink2Description: Application Note; ComponentLink2URL: *; ComponentLink3Description: Layout Guidelines; ComponentLink3URL: *; ComponentLink4Description: Technology Reference; ComponentLink4URL: *; Supplier1: *; Supplier2: *; Unit_Cost: *; MOQ: *; Leadtime: *; Inventory_Stock: *; Tolerance: *; Wattage: *; Voltage: *; Package: *; ComponentLink5Description: Production Detail; ComponentLink5URL: *; Note: *; Stock Code: *
U7 = SN74LVC2G07DBVR: Dual Buffer/Driver with open-drain output; Manufacturer: TI; Created_By: IN; Manufacturer_PN: SN74LVC2G07DBVR; Checked_By: *; Checked_Date: *; HelpURL: X:\Datasheets\By_Manufacturer\TI\sn74lvc2g07.pdf; ComponentLink1Description: Footprint Detail; ComponentLink2Description: Application Note; ComponentLink2URL: *; ComponentLink3Description: Layout Guidelines; ComponentLink3URL: *; ComponentLink4Description: Technology Reference; ComponentLink4URL: *; Supplier1: *; Supplier2: *; Unit_Cost: *; MOQ: *; Leadtime: *; Inventory_Stock: *; Tolerance: *; Wattage: *; Voltage: *; Package: *; ComponentLink5Description: Production Detail; ComponentLink5URL: *; Note: *; Stock Code: *
J5 = SAMTEC-TSM-105-01-TM-SV-5W-HDR: Value: SAMTEC-TSM-105-01-TM-SV-5W-HDR

## Sheet ADC-DMUX.SchDoc: <SPECIFIC SHEET FUNCTION>
size A3; Date: DO NOT USE, RATHER USE PROJ OPTIONS; DrawnBy: DO NOT USE, RATHER USE PROJ OPTIONS; Engineer: DO NOT USE, RATHER USE PROJ OPTIONS; Organization: DO NOT USE, RATHER USE PROJ OPTIONS; DocumentNumber: 2; Revision: DO NOT USE, RATHER USE PROJ OPTIONS; SheetNumber: 6; SheetTotal: 12; SCH_Sheet_Filename: ADC-DMUX.SchDoc; CurrentTime: DO NOT USE, RATHER USE PROJ OPTIONS; Time: DO NOT USE, RATHER USE PROJ OPTIONS; DocumentFullPathAndName: DO NOT USE, RATHER USE PROJ OPTIONS; DocumentName: DO NOT USE, RATHER USE PROJ OPTIONS; ModifiedDate: DO NOT USE, RATHER USE PROJ OPTIONS; ImagePath: DO NOT USE, RATHER USE PROJ OPTIONS
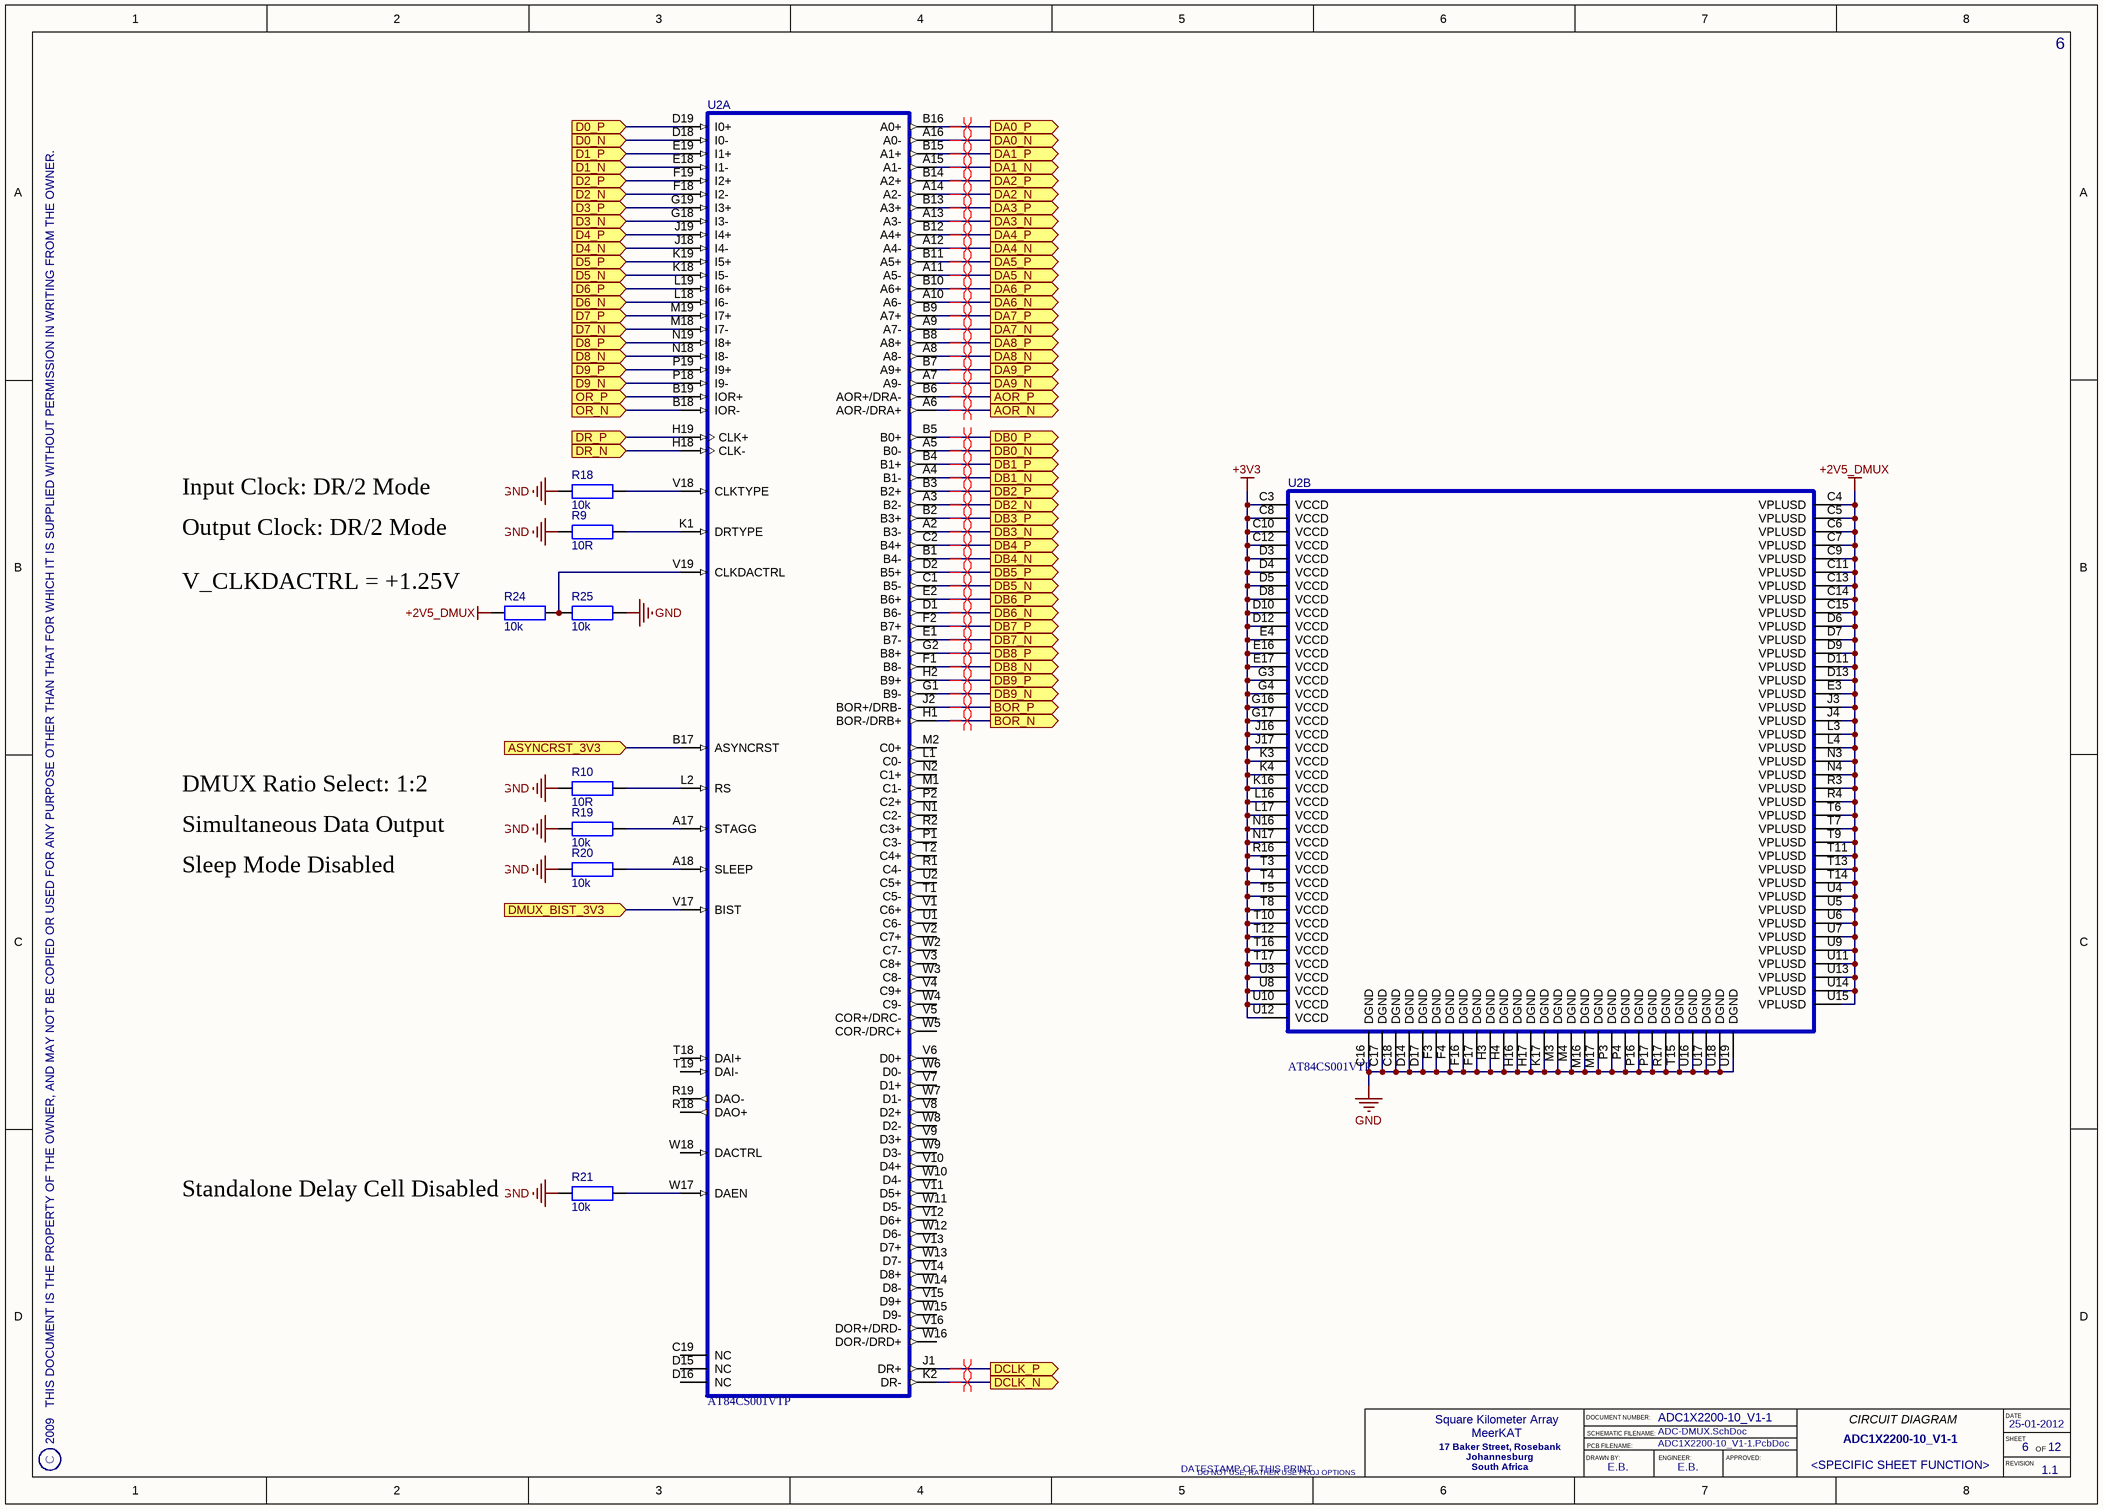
[diagram p4: ADC-DMUX.SchDoc]

### Parts
R9  10R  [0603]
R10  10R  [0603]
R18  10k  [0603]
R19  10k  [0603]
R20  10k  [0603]
R21  10k  [0603]
R24  10k  [0603]
R25  10k  [0603]
U2  AT84CS001VTP  [BGA240x19]  (parts A,B of 2)

### Ports
AOR_N (out), AOR_P (out), ASYNCRST_3V3 (in), BOR_N (out), BOR_P (out), D0_N (in), D0_P (in), D1_N (in), D1_P (in), D2_N (in), D2_P (in), D3_N (in), D3_P (in), D4_N (in), D4_P (in), D5_N (in), D5_P (in), D6_N (in), D6_P (in), D7_N (in), D7_P (in), D8_N (in), D8_P (in), D9_N (in), D9_P (in), DA0_N (out), DA0_P (out), DA1_N (out), DA1_P (out), DA2_N (out), DA2_P (out), DA3_N (out), DA3_P (out), DA4_N (out), DA4_P (out), DA5_N (out), DA5_P (out), DA6_N (out), DA6_P (out), DA7_N (out), DA7_P (out), DA8_N (out), DA8_P (out), DA9_N (out), DA9_P (out), DB0_N (out), DB0_P (out), DB1_N (out), DB1_P (out), DB2_N (out), DB2_P (out), DB3_N (out), DB3_P (out), DB4_N (out), DB4_P (out), DB5_N (out), DB5_P (out), DB6_N (out), DB6_P (out), DB7_N (out), DB7_P (out), DB8_N (out), DB8_P (out), DB9_N (out), DB9_P (out), DCLK_N (out), DCLK_P (out), DMUX_BIST_3V3 (in), DR_N (in), DR_P (in), OR_N (in), OR_P (in)

### Nets
+2V5_DMUX: R24.1 U2.C4(VPLUSD) U2.C5(VPLUSD) U2.C6(VPLUSD) U2.C7(VPLUSD) U2.C9(VPLUSD) U2.C11(VPLUSD) U2.C13(VPLUSD) U2.C14(VPLUSD) U2.C15(VPLUSD) U2.D6(VPLUSD) U2.D7(VPLUSD) U2.D9(VPLUSD) U2.D11(VPLUSD) U2.D13(VPLUSD) U2.E3(VPLUSD) U2.J3(VPLUSD) U2.J4(VPLUSD) U2.L3(VPLUSD) U2.L4(VPLUSD) U2.N3(VPLUSD) U2.N4(VPLUSD) U2.R3(VPLUSD) U2.R4(VPLUSD) U2.T6(VPLUSD) U2.T7(VPLUSD) U2.T9(VPLUSD) U2.T11(VPLUSD) U2.T13(VPLUSD) U2.T14(VPLUSD) U2.U4(VPLUSD) U2.U5(VPLUSD) U2.U6(VPLUSD) U2.U7(VPLUSD) U2.U9(VPLUSD) U2.U11(VPLUSD) U2.U13(VPLUSD) U2.U14(VPLUSD) U2.U15(VPLUSD)
+3V3: U2.C3(VCCD) U2.C8(VCCD) U2.C10(VCCD) U2.C12(VCCD) U2.D3(VCCD) U2.D4(VCCD) U2.D5(VCCD) U2.D8(VCCD) U2.D10(VCCD) U2.D12(VCCD) U2.E4(VCCD) U2.E16(VCCD) U2.E17(VCCD) U2.G3(VCCD) U2.G4(VCCD) U2.G16(VCCD) U2.G17(VCCD) U2.J16(VCCD) U2.J17(VCCD) U2.K3(VCCD) U2.K4(VCCD) U2.K16(VCCD) U2.L16(VCCD) U2.L17(VCCD) U2.N16(VCCD) U2.N17(VCCD) U2.R16(VCCD) U2.T3(VCCD) U2.T4(VCCD) U2.T5(VCCD) U2.T8(VCCD) U2.T10(VCCD) U2.T12(VCCD) U2.T16(VCCD) U2.T17(VCCD) U2.U3(VCCD) U2.U8(VCCD) U2.U10(VCCD) U2.U12(VCCD)
GND: R9.1 R10.1 R18.1 R19.1 R20.1 R21.1 R25.2 U2.C16(DGND) U2.C17(DGND) U2.C18(DGND) U2.D14(DGND) U2.D17(DGND) U2.F3(DGND) U2.F4(DGND) U2.F16(DGND) U2.F17(DGND) U2.H3(DGND) U2.H4(DGND) U2.H16(DGND) U2.H17(DGND) U2.K17(DGND) U2.M3(DGND) U2.M4(DGND) U2.M16(DGND) U2.M17(DGND) U2.P3(DGND) U2.P4(DGND) U2.P16(DGND) U2.P17(DGND) U2.R17(DGND) U2.T15(DGND) U2.U16(DGND) U2.U17(DGND) U2.U18(DGND) U2.U19(DGND)
AOR_N: U2.A6(AOR-/DRA+) ; port AOR_N
AOR_P: U2.B6(AOR+/DRA-) ; port AOR_P
ASYNCRST_3V3: U2.B17(ASYNCRST) ; port ASYNCRST_3V3
BOR_N: U2.H1(BOR-/DRB+) ; port BOR_N
BOR_P: U2.J2(BOR+/DRB-) ; port BOR_P
D0_N: U2.D18(I0-) ; port D0_N
D0_P: U2.D19(I0+) ; port D0_P
D1_N: U2.E18(I1-) ; port D1_N
D1_P: U2.E19(I1+) ; port D1_P
D2_N: U2.F18(I2-) ; port D2_N
D2_P: U2.F19(I2+) ; port D2_P
D3_N: U2.G18(I3-) ; port D3_N
D3_P: U2.G19(I3+) ; port D3_P
D4_N: U2.J18(I4-) ; port D4_N
D4_P: U2.J19(I4+) ; port D4_P
D5_N: U2.K18(I5-) ; port D5_N
D5_P: U2.K19(I5+) ; port D5_P
D6_N: U2.L18(I6-) ; port D6_N
D6_P: U2.L19(I6+) ; port D6_P
D7_N: U2.M18(I7-) ; port D7_N
D7_P: U2.M19(I7+) ; port D7_P
D8_N: U2.N18(I8-) ; port D8_N
D8_P: U2.N19(I8+) ; port D8_P
D9_N: U2.P18(I9-) ; port D9_N
D9_P: U2.P19(I9+) ; port D9_P
DA0_N: U2.A16(A0-) ; port DA0_N
DA0_P: U2.B16(A0+) ; port DA0_P
DA1_N: U2.A15(A1-) ; port DA1_N
DA1_P: U2.B15(A1+) ; port DA1_P
DA2_N: U2.A14(A2-) ; port DA2_N
DA2_P: U2.B14(A2+) ; port DA2_P
DA3_N: U2.A13(A3-) ; port DA3_N
DA3_P: U2.B13(A3+) ; port DA3_P
DA4_N: U2.A12(A4-) ; port DA4_N
DA4_P: U2.B12(A4+) ; port DA4_P
DA5_N: U2.A11(A5-) ; port DA5_N
DA5_P: U2.B11(A5+) ; port DA5_P
DA6_N: U2.A10(A6-) ; port DA6_N
DA6_P: U2.B10(A6+) ; port DA6_P
DA7_N: U2.A9(A7-) ; port DA7_N
DA7_P: U2.B9(A7+) ; port DA7_P
DA8_N: U2.A8(A8-) ; port DA8_N
DA8_P: U2.B8(A8+) ; port DA8_P
DA9_N: U2.A7(A9-) ; port DA9_N
DA9_P: U2.B7(A9+) ; port DA9_P
DB0_N: U2.A5(B0-) ; port DB0_N
DB0_P: U2.B5(B0+) ; port DB0_P
DB1_N: U2.A4(B1-) ; port DB1_N
DB1_P: U2.B4(B1+) ; port DB1_P
DB2_N: U2.A3(B2-) ; port DB2_N
DB2_P: U2.B3(B2+) ; port DB2_P
DB3_N: U2.A2(B3-) ; port DB3_N
DB3_P: U2.B2(B3+) ; port DB3_P
DB4_N: U2.B1(B4-) ; port DB4_N
DB4_P: U2.C2(B4+) ; port DB4_P
DB5_N: U2.C1(B5-) ; port DB5_N
DB5_P: U2.D2(B5+) ; port DB5_P
DB6_N: U2.D1(B6-) ; port DB6_N
DB6_P: U2.E2(B6+) ; port DB6_P
DB7_N: U2.E1(B7-) ; port DB7_N
DB7_P: U2.F2(B7+) ; port DB7_P
DB8_N: U2.F1(B8-) ; port DB8_N
DB8_P: U2.G2(B8+) ; port DB8_P
DB9_N: U2.G1(B9-) ; port DB9_N
DB9_P: U2.H2(B9+) ; port DB9_P
DCLK_N: U2.K2(DR-) ; port DCLK_N
DCLK_P: U2.J1(DR+) ; port DCLK_P
DMUX_BIST_3V3: U2.V17(BIST) ; port DMUX_BIST_3V3
DR_N: U2.H18(CLK-) ; port DR_N
DR_P: U2.H19(CLK+) ; port DR_P
OR_N: U2.B18(IOR-) ; port OR_N
OR_P: U2.B19(IOR+) ; port OR_P
NetR9_2: R9.2 U2.K1(DRTYPE)
NetR10_2: R10.2 U2.L2(RS)
NetR18_2: R18.2 U2.V18(CLKTYPE)
NetR19_2: R19.2 U2.A17(STAGG)
NetR20_2: R20.2 U2.A18(SLEEP)
NetR21_2: R21.2 U2.W17(DAEN)
NetR24_2: R24.2 R25.1 U2.V19(CLKDACTRL)

Not connected (* = marked no-connect by the designer): U2 C19(NC) D15(NC) D16(NC) L1(C0-) M1(C1-) M2(C0+) N1(C2-) N2(C1+) P1(C3-) P2(C2+) R1(C4-) R2(C3+) R18(DAO+) R19(DAO-) T1(C5-) T2(C4+) T18(DAI+) T19(DAI-) U1(C6-) U2(C5+) V1(C6+) V2(C7+) V3(C8+) V4(C9+) V5(COR+/DRC-) V6(D0+) V7(D1+) V8(D2+) V9(D3+) V10(D4+) V11(D5+) V12(D6+) V13(D7+) V14(D8+) V15(D9+) V16(DOR+/DRD-) W2(C7-) W3(C8-) W4(C9-) W5(COR-/DRC+) W6(D0-) W7(D1-) W8(D2-) W9(D3-) W10(D4-) W11(D5-) W12(D6-) W13(D7-) W14(D8-) W15(D9-) W16(DOR-/DRD+) W18(DACTRL)

### Layout directives
differential pair: AOR_N, AOR_P, BOR_N, BOR_P, DA0_N, DA0_P, DA1_N, DA1_P, DA2_N, DA2_P, DA3_N, DA3_P, DA4_N, DA4_P, DA5_N, DA5_P, DA6_N, DA6_P, DA7_N, DA7_P, DA8_N, DA8_P, DA9_N, DA9_P, DB0_N, DB0_P, DB1_N, DB1_P, DB2_N, DB2_P, DB3_N, DB3_P, DB4_N, DB4_P, DB5_N, DB5_P, DB6_N, DB6_P, DB7_N, DB7_P, DB8_N, DB8_P, DB9_N, DB9_P, DCLK_N, DCLK_P

### Notes on the sheet
- Input Clock: DR/2 Mode
- Output Clock: DR/2 Mode
- (near R24) V_CLKDACTRL = +1.25V
- Simultaneous Data Output
- DMUX Ratio Select: 1:2
- Sleep Mode Disabled
- Standalone Delay Cell Disabled
- 2009   THIS DOCUMENT IS THE PROPERTY OF THE OWNER, AND MAY NOT BE COPIED OR USED FOR ANY PURPOSE OTHER THAN THAT FOR WHICH IT IS SUPPLIED WITHOUT PERMISSION IN WRITING FROM THE OWNER.
- C
- DATESTAMP OF THIS PRINT
- DRAWN BY:
- DOCUMENT NUMBER:
- SCHEMATIC FILENAME:
- PCB FILENAME:
- ENGINEER:
- APPROVED:
- CIRCUIT DIAGRAM
- DATE
- SHEET
- REVISION
- OF

### Library data of the parts
R9 R10 R18-R21 R24 R25 = RES-0805: RESISTOR SMD 0603; Checked_By: NN; Manufacturer: *; Manufacturer_PN: *; Created_By: *; Checked_Date: 5-08-2009; HelpURL: *; ComponentLink1Description: Footprint Detail; ComponentLink1URL: *; ComponentLink2Description: Application Note; ComponentLink2URL: *; ComponentLink3Description: Layout Guidelines; ComponentLink3URL: *; ComponentLink4Description: Technology Reference; ComponentLink4URL: *; Supplier1: *; Supplier2: *; Unit_Cost: *; MOQ: *; Leadtime: *; Inventory_Stock: *; Tolerance: *; Wattage: *; Voltage: *; Package: 0603; ComponentLink5Description: Production Detail; ComponentLink5URL: *; Note: *; Stock Code: *
  R9 R10: Value: 10R
  R18-R21 R24 R25: Value: 10k
U2 = AT84CS001VTP: 10-bit 2.2Gsps 1:4 DMUX; Manufacturer: e2V; Created_By: IN; Manufacturer_PN: AT84CS001VTP; Checked_By: *; Checked_Date: *; HelpURL: X:\Datasheets\By_Manufacturer\National Semi\ADC08D1520.pdf; ComponentLink1Description: X:\Datasheets\By_Manufacturer\National Semi\ADC08D1520.pdf#page=4; ComponentLink1URL: *; ComponentLink2Description: Application Note; ComponentLink2URL: *; ComponentLink3Description: Layout Guidelines; ComponentLink3URL: *; ComponentLink4Description: Technology Reference; ComponentLink4URL: *; Supplier1: *; Supplier2: *; Unit_Cost: *; MOQ: *; Leadtime: *; Inventory_Stock: *; Tolerance: *; Wattage: *; Voltage: *; Package: *; ComponentLink5Description: Production Detail; ComponentLink5URL: *; Note: *; Stock Code: *

## Sheet ADC-Z-DOK.SchDoc: <SPECIFIC SHEET FUNCTION>
size A3; Date: DO NOT USE, RATHER USE PROJ OPTIONS; DrawnBy: DO NOT USE, RATHER USE PROJ OPTIONS; Engineer: DO NOT USE, RATHER USE PROJ OPTIONS; Organization: DO NOT USE, RATHER USE PROJ OPTIONS; DocumentNumber: 6; Revision: DO NOT USE, RATHER USE PROJ OPTIONS; SheetNumber: 2; SheetTotal: 12; SCH_Sheet_Filename: ADC-Z-DOK.SchDoc; CurrentTime: DO NOT USE, RATHER USE PROJ OPTIONS; Time: DO NOT USE, RATHER USE PROJ OPTIONS; DocumentFullPathAndName: DO NOT USE, RATHER USE PROJ OPTIONS; DocumentName: DO NOT USE, RATHER USE PROJ OPTIONS; ModifiedDate: DO NOT USE, RATHER USE PROJ OPTIONS; ImagePath: DO NOT USE, RATHER USE PROJ OPTIONS
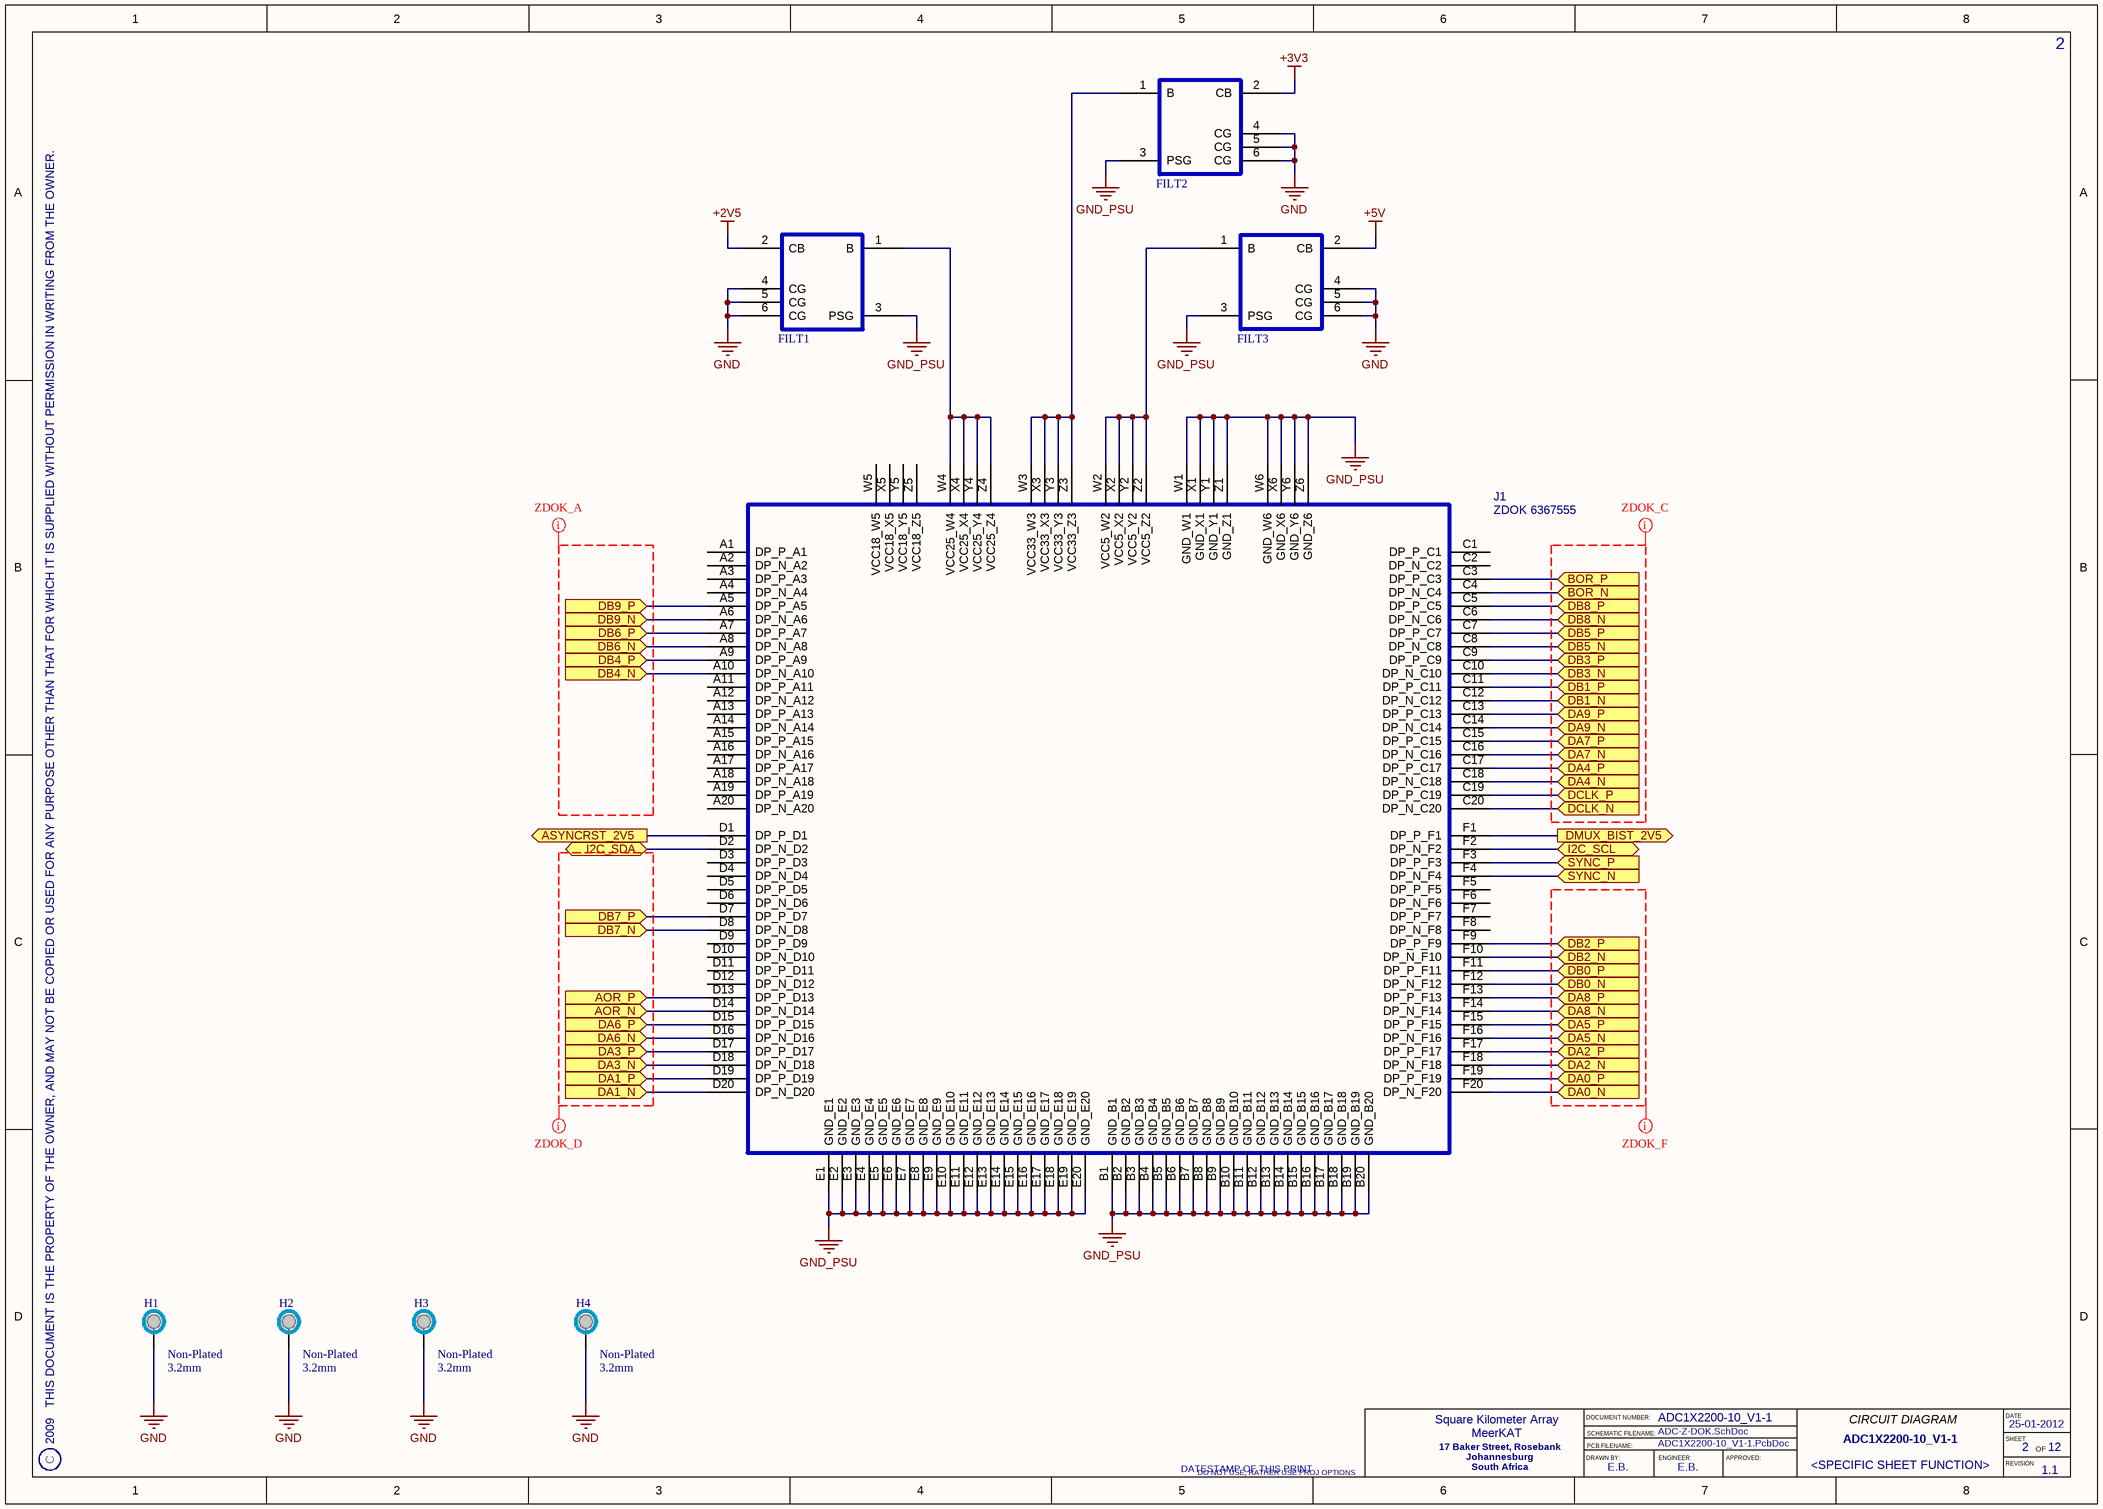
[diagram p5: ADC-Z-DOK.SchDoc]

### Parts
FILT1  BNX002-01  [BNX002-01]  (value not drawn)
FILT2  BNX002-01  [BNX002-01]  (value not drawn)
FILT3  BNX002-01  [BNX002-01]  (value not drawn)
H1  Non-Plated  HoleDia: 3.2mm  [HOLE]  (no BOM)
H2  Non-Plated  HoleDia: 3.2mm  [HOLE]  (no BOM)
H3  Non-Plated  HoleDia: 3.2mm  [HOLE]  (no BOM)
H4  Non-Plated  HoleDia: 3.2mm  [HOLE]  (no BOM)
J1  Z-DOK  [TYCO6367555]  (value not drawn)

### Ports
AOR_N (in), AOR_P (in), ASYNCRST_2V5 (out), BOR_N (in), BOR_P (in), DA0_N (in), DA0_P (in), DA1_N (in), DA1_P (in), DA2_N (in), DA2_P (in), DA3_N (in), DA3_P (in), DA4_N (in), DA4_P (in), DA5_N (in), DA5_P (in), DA6_N (in), DA6_P (in), DA7_N (in), DA7_P (in), DA8_N (in), DA8_P (in), DA9_N (in), DA9_P (in), DB0_N (in), DB0_P (in), DB1_N (in), DB1_P (in), DB2_N (in), DB2_P (in), DB3_N (in), DB3_P (in), DB4_N (in), DB4_P (in), DB5_N (in), DB5_P (in), DB6_N (in), DB6_P (in), DB7_N (in), DB7_P (in), DB8_N (in), DB8_P (in), DB9_N (in), DB9_P (in), DCLK_N (in), DCLK_P (in), DMUX_BIST_2V5 (out), I2C_SCL (bidir), I2C_SDA (bidir), SYNC_N (in), SYNC_P (in)

### Nets
+2V5: FILT1.2(CB)
+3V3: FILT2.2(CB)
+5V: FILT3.2(CB)
GND: FILT1.4(CG) FILT1.5(CG) FILT1.6(CG) FILT2.4(CG) FILT2.5(CG) FILT2.6(CG) FILT3.4(CG) FILT3.5(CG) FILT3.6(CG) H1.1(TP) H2.1(TP) H3.1(TP) H4.1(TP)
GND_PSU: FILT1.3(PSG) FILT2.3(PSG) FILT3.3(PSG) J1.B1(GND_B1) J1.B2(GND_B2) J1.B3(GND_B3) J1.B4(GND_B4) J1.B5(GND_B5) J1.B6(GND_B6) J1.B7(GND_B7) J1.B8(GND_B8) J1.B9(GND_B9) J1.B10(GND_B10) J1.B11(GND_B11) J1.B12(GND_B12) J1.B13(GND_B13) J1.B14(GND_B14) J1.B15(GND_B15) J1.B16(GND_B16) J1.B17(GND_B17) J1.B18(GND_B18) J1.B19(GND_B19) J1.B20(GND_B20) J1.E1(GND_E1) J1.E2(GND_E2) J1.E3(GND_E3) J1.E4(GND_E4) J1.E5(GND_E5) J1.E6(GND_E6) J1.E7(GND_E7) J1.E8(GND_E8) J1.E9(GND_E9) J1.E10(GND_E10) J1.E11(GND_E11) J1.E12(GND_E12) J1.E13(GND_E13) J1.E14(GND_E14) J1.E15(GND_E15) J1.E16(GND_E16) J1.E17(GND_E17) J1.E18(GND_E18) J1.E19(GND_E19) J1.E20(GND_E20) J1.W1(GND_W1) J1.W6(GND_W6) J1.X1(GND_X1) J1.X6(GND_X6) J1.Y1(GND_Y1) J1.Y6(GND_Y6) J1.Z1(GND_Z1) J1.Z6(GND_Z6)
AOR_N: J1.D14(DP_N_D14) ; port AOR_N
AOR_P: J1.D13(DP_P_D13) ; port AOR_P
ASYNCRST_2V5: J1.D1(DP_P_D1) ; port ASYNCRST_2V5
BOR_N: J1.C4(DP_N_C4) ; port BOR_N
BOR_P: J1.C3(DP_P_C3) ; port BOR_P
DA0_N: J1.F20(DP_N_F20) ; port DA0_N
DA0_P: J1.F19(DP_P_F19) ; port DA0_P
DA1_N: J1.D20(DP_N_D20) ; port DA1_N
DA1_P: J1.D19(DP_P_D19) ; port DA1_P
DA2_N: J1.F18(DP_N_F18) ; port DA2_N
DA2_P: J1.F17(DP_P_F17) ; port DA2_P
DA3_N: J1.D18(DP_N_D18) ; port DA3_N
DA3_P: J1.D17(DP_P_D17) ; port DA3_P
DA4_N: J1.C18(DP_N_C18) ; port DA4_N
DA4_P: J1.C17(DP_P_C17) ; port DA4_P
DA5_N: J1.F16(DP_N_F16) ; port DA5_N
DA5_P: J1.F15(DP_P_F15) ; port DA5_P
DA6_N: J1.D16(DP_N_D16) ; port DA6_N
DA6_P: J1.D15(DP_P_D15) ; port DA6_P
DA7_N: J1.C16(DP_N_C16) ; port DA7_N
DA7_P: J1.C15(DP_P_C15) ; port DA7_P
DA8_N: J1.F14(DP_N_F14) ; port DA8_N
DA8_P: J1.F13(DP_P_F13) ; port DA8_P
DA9_N: J1.C14(DP_N_C14) ; port DA9_N
DA9_P: J1.C13(DP_P_C13) ; port DA9_P
DB0_N: J1.F12(DP_N_F12) ; port DB0_N
DB0_P: J1.F11(DP_P_F11) ; port DB0_P
DB1_N: J1.C12(DP_N_C12) ; port DB1_N
DB1_P: J1.C11(DP_P_C11) ; port DB1_P
DB2_N: J1.F10(DP_N_F10) ; port DB2_N
DB2_P: J1.F9(DP_P_F9) ; port DB2_P
DB3_N: J1.C10(DP_N_C10) ; port DB3_N
DB3_P: J1.C9(DP_P_C9) ; port DB3_P
DB4_N: J1.A10(DP_N_A10) ; port DB4_N
DB4_P: J1.A9(DP_P_A9) ; port DB4_P
DB5_N: J1.C8(DP_N_C8) ; port DB5_N
DB5_P: J1.C7(DP_P_C7) ; port DB5_P
DB6_N: J1.A8(DP_N_A8) ; port DB6_N
DB6_P: J1.A7(DP_P_A7) ; port DB6_P
DB7_N: J1.D8(DP_N_D8) ; port DB7_N
DB7_P: J1.D7(DP_P_D7) ; port DB7_P
DB8_N: J1.C6(DP_N_C6) ; port DB8_N
DB8_P: J1.C5(DP_P_C5) ; port DB8_P
DB9_N: J1.A6(DP_N_A6) ; port DB9_N
DB9_P: J1.A5(DP_P_A5) ; port DB9_P
DCLK_N: J1.C20(DP_N_C20) ; port DCLK_N
DCLK_P: J1.C19(DP_P_C19) ; port DCLK_P
DMUX_BIST_2V5: J1.F1(DP_P_F1) ; port DMUX_BIST_2V5
I2C_SCL: J1.F2(DP_N_F2) ; port I2C_SCL
I2C_SDA: J1.D2(DP_N_D2) ; port I2C_SDA
SYNC_N: J1.F4(DP_N_F4) ; port SYNC_N
SYNC_P: J1.F3(DP_P_F3) ; port SYNC_P
NetFILT1_1: FILT1.1(B) J1.W4(VCC25_W4) J1.X4(VCC25_X4) J1.Y4(VCC25_Y4) J1.Z4(VCC25_Z4)
NetFILT2_1: FILT2.1(B) J1.W3(VCC33_W3) J1.X3(VCC33_X3) J1.Y3(VCC33_Y3) J1.Z3(VCC33_Z3)
NetFILT3_1: FILT3.1(B) J1.W2(VCC5_W2) J1.X2(VCC5_X2) J1.Y2(VCC5_Y2) J1.Z2(VCC5_Z2)

Not connected (* = marked no-connect by the designer): J1 A1(DP_P_A1) A2(DP_N_A2) A3(DP_P_A3) A4(DP_N_A4) A11(DP_P_A11) A12(DP_N_A12) A13(DP_P_A13) A14(DP_N_A14) A15(DP_P_A15) A16(DP_N_A16) A17(DP_P_A17) A18(DP_N_A18) A19(DP_P_A19) A20(DP_N_A20) C1(DP_P_C1) C2(DP_N_C2) D3(DP_P_D3) D4(DP_N_D4) D5(DP_P_D5) D6(DP_N_D6) D9(DP_P_D9) D10(DP_N_D10) D11(DP_P_D11) D12(DP_N_D12) F5(DP_P_F5) F6(DP_N_F6) F7(DP_P_F7) F8(DP_N_F8) W5(VCC18_W5) X5(VCC18_X5) Y5(VCC18_Y5) Z5(VCC18_Z5)

### Layout directives
net class ZDOK_A: (no net found under the mark)
net class ZDOK_D: (no net found under the mark)
net class ZDOK_C: (no net found under the mark)
net class ZDOK_F: (no net found under the mark)

### Notes on the sheet
- 2009   THIS DOCUMENT IS THE PROPERTY OF THE OWNER, AND MAY NOT BE COPIED OR USED FOR ANY PURPOSE OTHER THAN THAT FOR WHICH IT IS SUPPLIED WITHOUT PERMISSION IN WRITING FROM THE OWNER.
- C
- DATESTAMP OF THIS PRINT
- DRAWN BY:
- DOCUMENT NUMBER:
- SCHEMATIC FILENAME:
- PCB FILENAME:
- ENGINEER:
- APPROVED:
- CIRCUIT DIAGRAM
- DATE
- SHEET
- REVISION
- OF

### Library data of the parts
H1-H4 = Unplated Hole_3.2mm: PCB Mounting Hole; Category: Mounting Hole
J1 = ZDOK 6367555: Created_By: CT; Manufacturer: Z-DOK; Checked_By: *; Checked_Date: *; HelpURL: ENG_CS_1773095_Backplane_Connectors_Z-DOK_1208.pdf; ComponentLink1Description: Footprint Detail; ComponentLink1URL: ENG_CS_1773095_Backplane_Connectors_Z-DOK_1208.pdf#page=4; ComponentLink2Description: Application Note; ComponentLink2URL: *; ComponentLink3Description: Layout Guidelines; ComponentLink3URL: *; ComponentLink4Description: Technology Reference; ComponentLink4URL: *; Supplier1: *; Supplier2: *; Unit_Cost: *; MOQ: *; Leadtime: *; Inventory_Stock: *; Tolerance: *; Wattage: *; Package: *; ComponentLink5Description: Production Detail; ComponentLink5URL: *; Note: *; Stock Code: *; Manufacturer_PN: ZDOK 6367555
FILT1-FILT3 = BNX002-01: Checked_By: *; Checked_Date: *; HelpURL: *; Supplier1: *; Supplier2: *; Unit_Cost: *; MOQ: *; Leadtime: *; Inventory_Stock: *; Tolerance: *; Wattage: *; Package: BNX002-01; ComponentLinked1Description: *; ComponentLinked1URL: *; ComponentLinked2Description: *; ComponentLinked2URL: *; ComponentLinked3Description: *; ComponentLinked3URL: *; ComponentLinked4Description: *; ComponentLinked4URL: *

## Sheet ADC-ADC.SchDoc: <SPECIFIC SHEET FUNCTION>
size A3; Date: DO NOT USE, RATHER USE PROJ OPTIONS; DrawnBy: DO NOT USE, RATHER USE PROJ OPTIONS; Engineer: DO NOT USE, RATHER USE PROJ OPTIONS; Organization: DO NOT USE, RATHER USE PROJ OPTIONS; DocumentNumber: 10; Revision: DO NOT USE, RATHER USE PROJ OPTIONS; SheetNumber: 5; SheetTotal: 12; SCH_Sheet_Filename: ADC-ADC.SchDoc; CurrentTime: DO NOT USE, RATHER USE PROJ OPTIONS; Time: DO NOT USE, RATHER USE PROJ OPTIONS; DocumentFullPathAndName: DO NOT USE, RATHER USE PROJ OPTIONS; DocumentName: DO NOT USE, RATHER USE PROJ OPTIONS; ModifiedDate: DO NOT USE, RATHER USE PROJ OPTIONS; ImagePath: DO NOT USE, RATHER USE PROJ OPTIONS
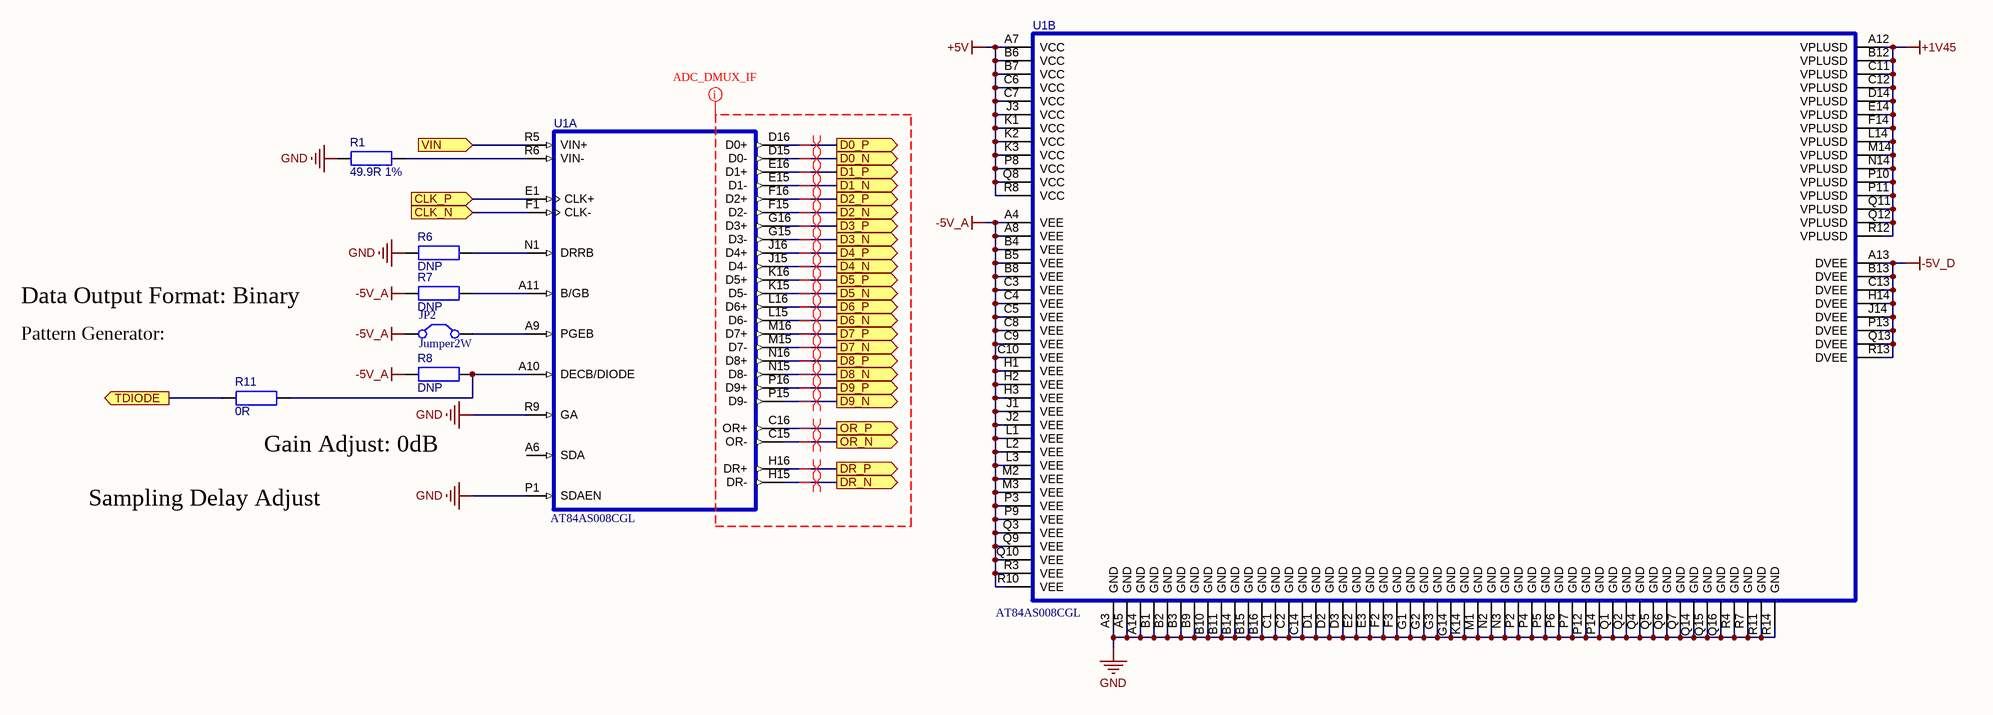
[diagram p6: ADC-ADC.SchDoc]

### Parts
JP2  Jumper2W  [JP-100MIL]
R1  49.9R 1%  [0603]
R6  DNP  [0603]
R7  DNP  [0603]
R8  DNP  [0603]
R11  0R  [0603]
U1  AT84AS008CGL  [BGA156x16]  (parts A,B of 2)

### Ports
CLK_N (in), CLK_P (in), D0_N (out), D0_P (out), D1_N (out), D1_P (out), D2_N (out), D2_P (out), D3_N (out), D3_P (out), D4_N (out), D4_P (out), D5_N (out), D5_P (out), D6_N (out), D6_P (out), D7_N (out), D7_P (out), D8_N (out), D8_P (out), D9_N (out), D9_P (out), DR_N (out), DR_P (out), OR_N (out), OR_P (out), TDIODE (out), VIN (in)

### Nets
+1V45: U1.A12(VPLUSD) U1.B12(VPLUSD) U1.C11(VPLUSD) U1.C12(VPLUSD) U1.D14(VPLUSD) U1.E14(VPLUSD) U1.F14(VPLUSD) U1.L14(VPLUSD) U1.M14(VPLUSD) U1.N14(VPLUSD) U1.P10(VPLUSD) U1.P11(VPLUSD) U1.Q11(VPLUSD) U1.Q12(VPLUSD) U1.R12(VPLUSD)
+5V: U1.A7(VCC) U1.B6(VCC) U1.B7(VCC) U1.C6(VCC) U1.C7(VCC) U1.J3(VCC) U1.K1(VCC) U1.K2(VCC) U1.K3(VCC) U1.P8(VCC) U1.Q8(VCC) U1.R8(VCC)
-5V_A: JP2.1(C1) R7.1 R8.1 U1.A4(VEE) U1.A8(VEE) U1.B4(VEE) U1.B5(VEE) U1.B8(VEE) U1.C3(VEE) U1.C4(VEE) U1.C5(VEE) U1.C8(VEE) U1.C9(VEE) U1.C10(VEE) U1.H1(VEE) U1.H2(VEE) U1.H3(VEE) U1.J1(VEE) U1.J2(VEE) U1.L1(VEE) U1.L2(VEE) U1.L3(VEE) U1.M2(VEE) U1.M3(VEE) U1.P3(VEE) U1.P9(VEE) U1.Q3(VEE) U1.Q9(VEE) U1.Q10(VEE) U1.R3(VEE) U1.R10(VEE)
-5V_D: U1.A13(DVEE) U1.B13(DVEE) U1.C13(DVEE) U1.H14(DVEE) U1.J14(DVEE) U1.P13(DVEE) U1.Q13(DVEE) U1.R13(DVEE)
GND: R1.1 R6.1 U1.A3(GND) U1.A5(GND) U1.A14(GND) U1.B1(GND) U1.B2(GND) U1.B3(GND) U1.B9(GND) U1.B10(GND) U1.B11(GND) U1.B14(GND) U1.B15(GND) U1.B16(GND) U1.C1(GND) U1.C2(GND) U1.C14(GND) U1.D1(GND) U1.D2(GND) U1.D3(GND) U1.E2(GND) U1.E3(GND) U1.F2(GND) U1.F3(GND) U1.G1(GND) U1.G2(GND) U1.G3(GND) U1.G14(GND) U1.K14(GND) U1.M1(GND) U1.N2(GND) U1.N3(GND) U1.P1(SDAEN) U1.P2(GND) U1.P4(GND) U1.P5(GND) U1.P6(GND) U1.P7(GND) U1.P12(GND) U1.P14(GND) U1.Q1(GND) U1.Q2(GND) U1.Q4(GND) U1.Q5(GND) U1.Q6(GND) U1.Q7(GND) U1.Q14(GND) U1.Q15(GND) U1.Q16(GND) U1.R4(GND) U1.R7(GND) U1.R9(GA) U1.R11(GND) U1.R14(GND)
CLK_N: U1.F1(CLK-) ; port CLK_N
CLK_P: U1.E1(CLK+) ; port CLK_P
D0_N: U1.D15(D0-) ; port D0_N
D0_P: U1.D16(D0+) ; port D0_P
D1_N: U1.E15(D1-) ; port D1_N
D1_P: U1.E16(D1+) ; port D1_P
D2_N: U1.F15(D2-) ; port D2_N
D2_P: U1.F16(D2+) ; port D2_P
D3_N: U1.G15(D3-) ; port D3_N
D3_P: U1.G16(D3+) ; port D3_P
D4_N: U1.J15(D4-) ; port D4_N
D4_P: U1.J16(D4+) ; port D4_P
D5_N: U1.K15(D5-) ; port D5_N
D5_P: U1.K16(D5+) ; port D5_P
D6_N: U1.L15(D6-) ; port D6_N
D6_P: U1.L16(D6+) ; port D6_P
D7_N: U1.M15(D7-) ; port D7_N
D7_P: U1.M16(D7+) ; port D7_P
D8_N: U1.N15(D8-) ; port D8_N
D8_P: U1.N16(D8+) ; port D8_P
D9_N: U1.P15(D9-) ; port D9_N
D9_P: U1.P16(D9+) ; port D9_P
DR_N: U1.H15(DR-) ; port DR_N
DR_P: U1.H16(DR+) ; port DR_P
OR_N: U1.C15(OR-) ; port OR_N
OR_P: U1.C16(OR+) ; port OR_P
TDIODE: R11.1 ; port TDIODE
VIN: U1.R5(VIN+) ; port VIN
NetJP2_2: JP2.2(C2) U1.A9(PGEB)
NetR1_2: R1.2 U1.R6(VIN-)
NetR6_2: R6.2 U1.N1(DRRB)
NetR7_2: R7.2 U1.A11(B/GB)
NetR8_2: R8.2 R11.2 U1.A10(DECB/DIODE)

Not connected (* = marked no-connect by the designer): U1 A6(SDA)

### Layout directives
differential pair: D0_N, D0_P, D1_N, D1_P, D2_N, D2_P, D3_N, D3_P, D4_N, D4_P, D5_N, D5_P, D6_N, D6_P, D7_N, D7_P, D8_N, D8_P, D9_N, D9_P, DR_N, DR_P, OR_N, OR_P
net class ADC_DMUX_IF: (no net found under the mark)

### Notes on the sheet
- Data Output Format: Binary
- (near R11) Pattern Generator:
  Open - Disabled / Closed - Checker Board
- (near R11) Gain Adjust: 0dB
- Sampling Delay Adjust Disabled
- 2009   THIS DOCUMENT IS THE PROPERTY OF THE OWNER, AND MAY NOT BE COPIED OR USED FOR ANY PURPOSE OTHER THAN THAT FOR WHICH IT IS SUPPLIED WITHOUT PERMISSION IN WRITING FROM THE OWNER.
- C
- DATESTAMP OF THIS PRINT
- DRAWN BY:
- DOCUMENT NUMBER:
- SCHEMATIC FILENAME:
- PCB FILENAME:
- ENGINEER:
- APPROVED:
- CIRCUIT DIAGRAM
- DATE
- SHEET
- REVISION
- OF

### Library data of the parts
JP2 = Jumper2W: Jumper Wire; Published: 24-Mar-1999; LatestRevisionDate: 17-Jul-2002; LatestRevisionNote: Re-released for DXP Platform.; PackageReference: RAD-0.2; Publisher: Altium Limited
R1 = RES-0805: RESISTOR SMD 0805; Checked_By: NN; Manufacturer: *; Manufacturer_PN: *; Created_By: *; Checked_Date: 5-08-2009; HelpURL: *; ComponentLink1Description: Footprint Detail; ComponentLink1URL: *; ComponentLink2Description: Application Note; ComponentLink2URL: *; ComponentLink3Description: Layout Guidelines; ComponentLink3URL: *; ComponentLink4Description: Technology Reference; ComponentLink4URL: *; Supplier1: *; Supplier2: *; Unit_Cost: *; MOQ: *; Leadtime: *; Inventory_Stock: *; Tolerance: *; Wattage: *; Voltage: *; Package: 0805; ComponentLink5Description: Production Detail; ComponentLink5URL: *; Note: *; Stock Code: *; Value: 49.9R 1%
R6-R8 R11 = RES-0805: RESISTOR SMD 0603; Checked_By: NN; Manufacturer: *; Manufacturer_PN: *; Created_By: *; Checked_Date: 5-08-2009; HelpURL: *; ComponentLink1Description: Footprint Detail; ComponentLink1URL: *; ComponentLink2Description: Application Note; ComponentLink2URL: *; ComponentLink3Description: Layout Guidelines; ComponentLink3URL: *; ComponentLink4Description: Technology Reference; ComponentLink4URL: *; Supplier1: *; Supplier2: *; Unit_Cost: *; MOQ: *; Leadtime: *; Inventory_Stock: *; Tolerance: *; Wattage: *; Voltage: *; Package: 0603; ComponentLink5Description: Production Detail; ComponentLink5URL: *; Note: *; Stock Code: *
  R6-R8: Value: DNP
  R11: Value: 0R
U1 = AT84AS008CGL: 10-bit 2.2Gsps ADC; Manufacturer: e2V; Created_By: IN; Manufacturer_PN: AT84AS008CGL; Checked_By: *; Checked_Date: *; HelpURL: X:\Datasheets\By_Manufacturer\National Semi\ADC08D1520.pdf; ComponentLink1Description: X:\Datasheets\By_Manufacturer\National Semi\ADC08D1520.pdf#page=4; ComponentLink1URL: *; ComponentLink2Description: Application Note; ComponentLink2URL: *; ComponentLink3Description: Layout Guidelines; ComponentLink3URL: *; ComponentLink4Description: Technology Reference; ComponentLink4URL: *; Supplier1: *; Supplier2: *; Unit_Cost: *; MOQ: *; Leadtime: *; Inventory_Stock: *; Tolerance: *; Wattage: *; Voltage: *; Package: *; ComponentLink5Description: Production Detail; ComponentLink5URL: *; Note: *; Stock Code: *